# Altium project devkit-visao.PrjPcb (part 1 of 2)
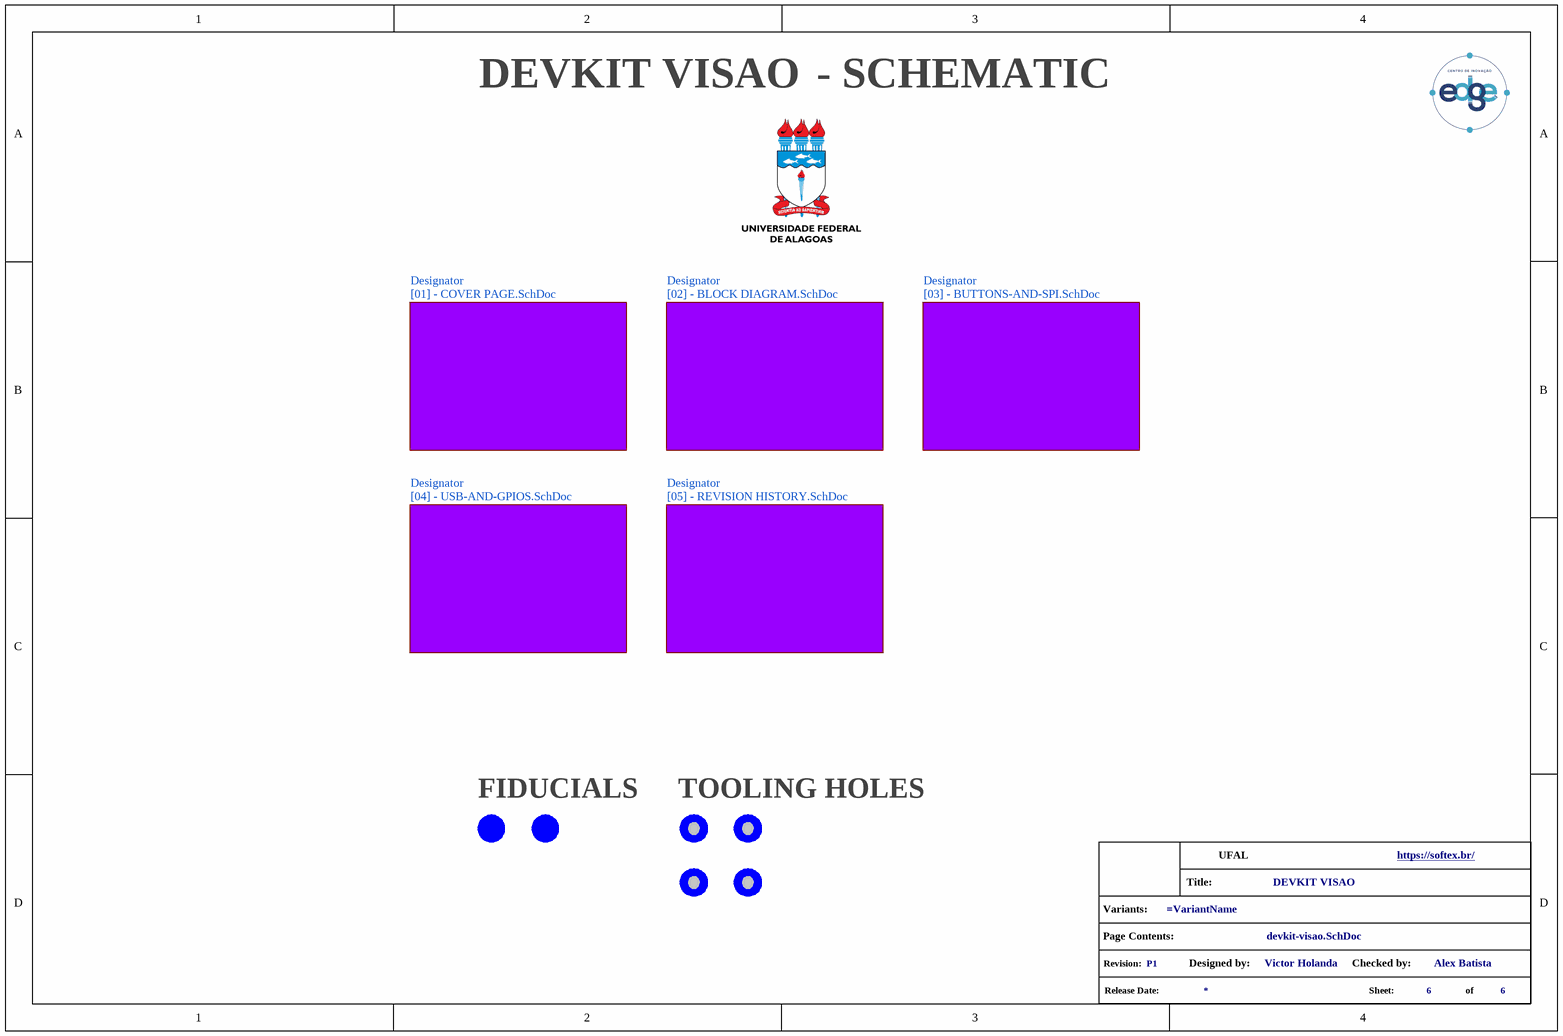
[diagram p0: devkit-visao.SchDoc]
CheckedProject: Alex Batista; Company: UFAL; DesignedProject: Victor Holanda; NotFitted: NF; TitleProject: DEVKIT VISAO; VersionRevision: P1; Website: https://softex.br/
6 sheets, 135 parts. Net scope: global (net labels, ports and power ports of the same name join across sheets).
Board file: devkit-visao.PcbDoc
Sheets:
  devkit-visao.SchDoc
    Designator = [02] - BLOCK DIAGRAM.SchDoc
    Designator = [01] - COVER PAGE.SchDoc
    Designator = [04] - USB-AND-GPIOS.SchDoc
    Designator = [05] - REVISION HISTORY.SchDoc
    Designator = [03] - BUTTONS-AND-SPI.SchDoc

## Sheet devkit-visao.SchDoc
size A4; DocumentNumber: 6; SheetNumber: 6; SheetTotal: 6

### Parts
(Parts that share a designator on the sheet are numbered #1, #2 ... from top to bottom, then left to right.)
*?#1  info_project  (value not drawn)  (graphical)
FID1  FID_40X1.20  [FID_40X1.20]  (value not drawn)  (no BOM)
FID2  FID_40X1.20  [FID_40X1.20]  (value not drawn)  (no BOM)
TH1  Tooling Hole  [Tooling Hole]  (value not drawn)  (no BOM)
TH2  Tooling Hole  [Tooling Hole]  (value not drawn)  (no BOM)
TH3  Tooling Hole  [Tooling Hole]  (value not drawn)  (no BOM)
TH4  Tooling Hole  [Tooling Hole]  (value not drawn)  (no BOM)

### Sub-sheets
Designator = [02] - BLOCK DIAGRAM.SchDoc: no entries
Designator = [01] - COVER PAGE.SchDoc: no entries
Designator = [04] - USB-AND-GPIOS.SchDoc: no entries
Designator = [05] - REVISION HISTORY.SchDoc: no entries
Designator = [03] - BUTTONS-AND-SPI.SchDoc: no entries

### Notes on the sheet
- - SCHEMATIC
- FIDUCIALS
- TOOLING HOLES
- (in symbol info_project) Title:; Variants:; Page Contents:; Revision:; Designed by:; Checked by:; Release Date:; Sheet:; of

### Library data of the parts
*?#1 = info_project: GRAPHICAL - Info Project
FID1 FID2 = FID_40X1.20: Fiducials
TH1-TH4 = Tooling Hole: MECH - Tooling Holes

## Sheet [02] - BLOCK DIAGRAM.SchDoc
size A2; DocumentNumber: 2; SheetNumber: 2; SheetTotal: 6; PageSetup: Record=PageOptions|CenterHorizontal=True|CenterVertical=True|PrintScale=0.52|XCorrection=1.00|YCorrection=1.00|PrintKind=1|BorderSize=5000000|LeftOffset=0|BottomOffset=0|Orientation=2|PaperLength=1000|PaperWidth=1000|Scale=100|PaperSource=4|PrintQuality=600|MediaType=1|DitherType=10|PrintScaleMode=1|PaperKind=A4|PaperIndex=9
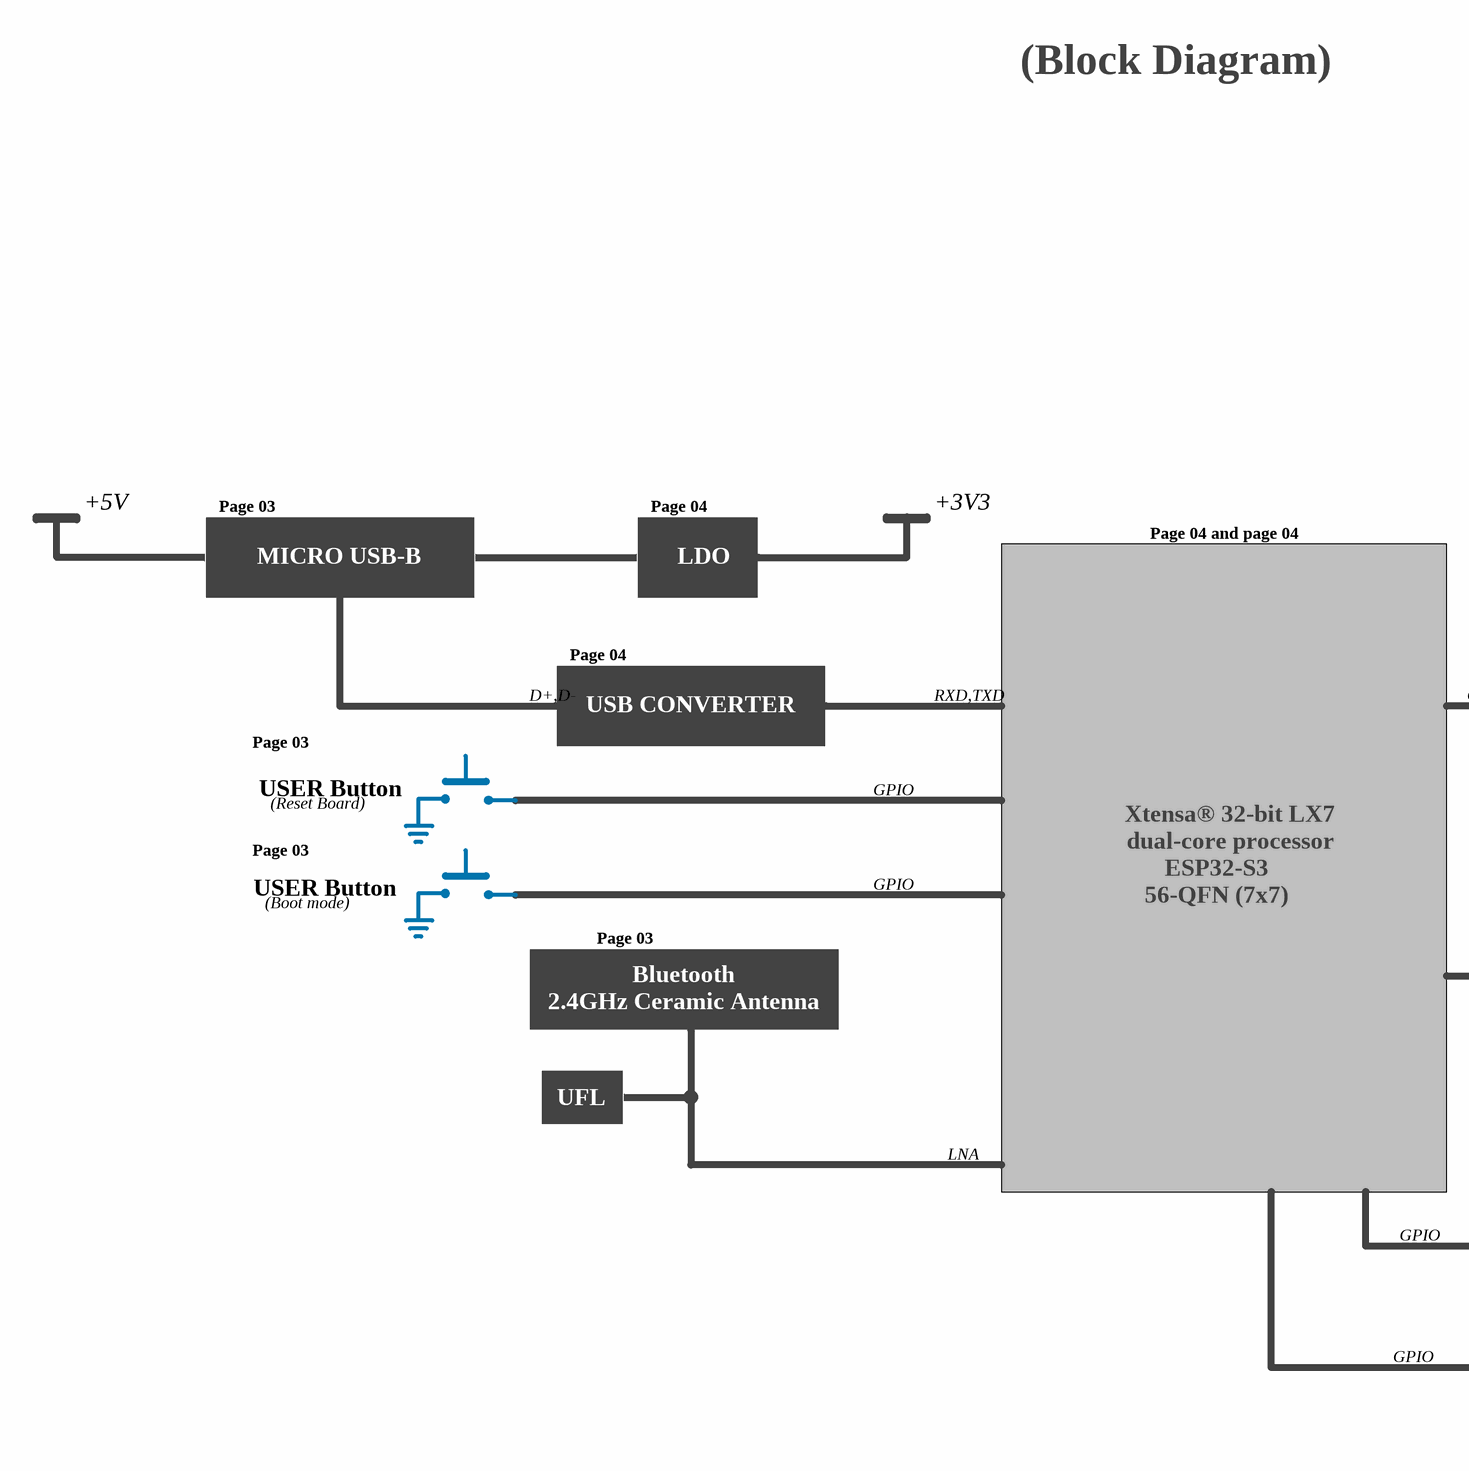
[diagram p1: [02] - BLOCK DIAGRAM.SchDoc, left]
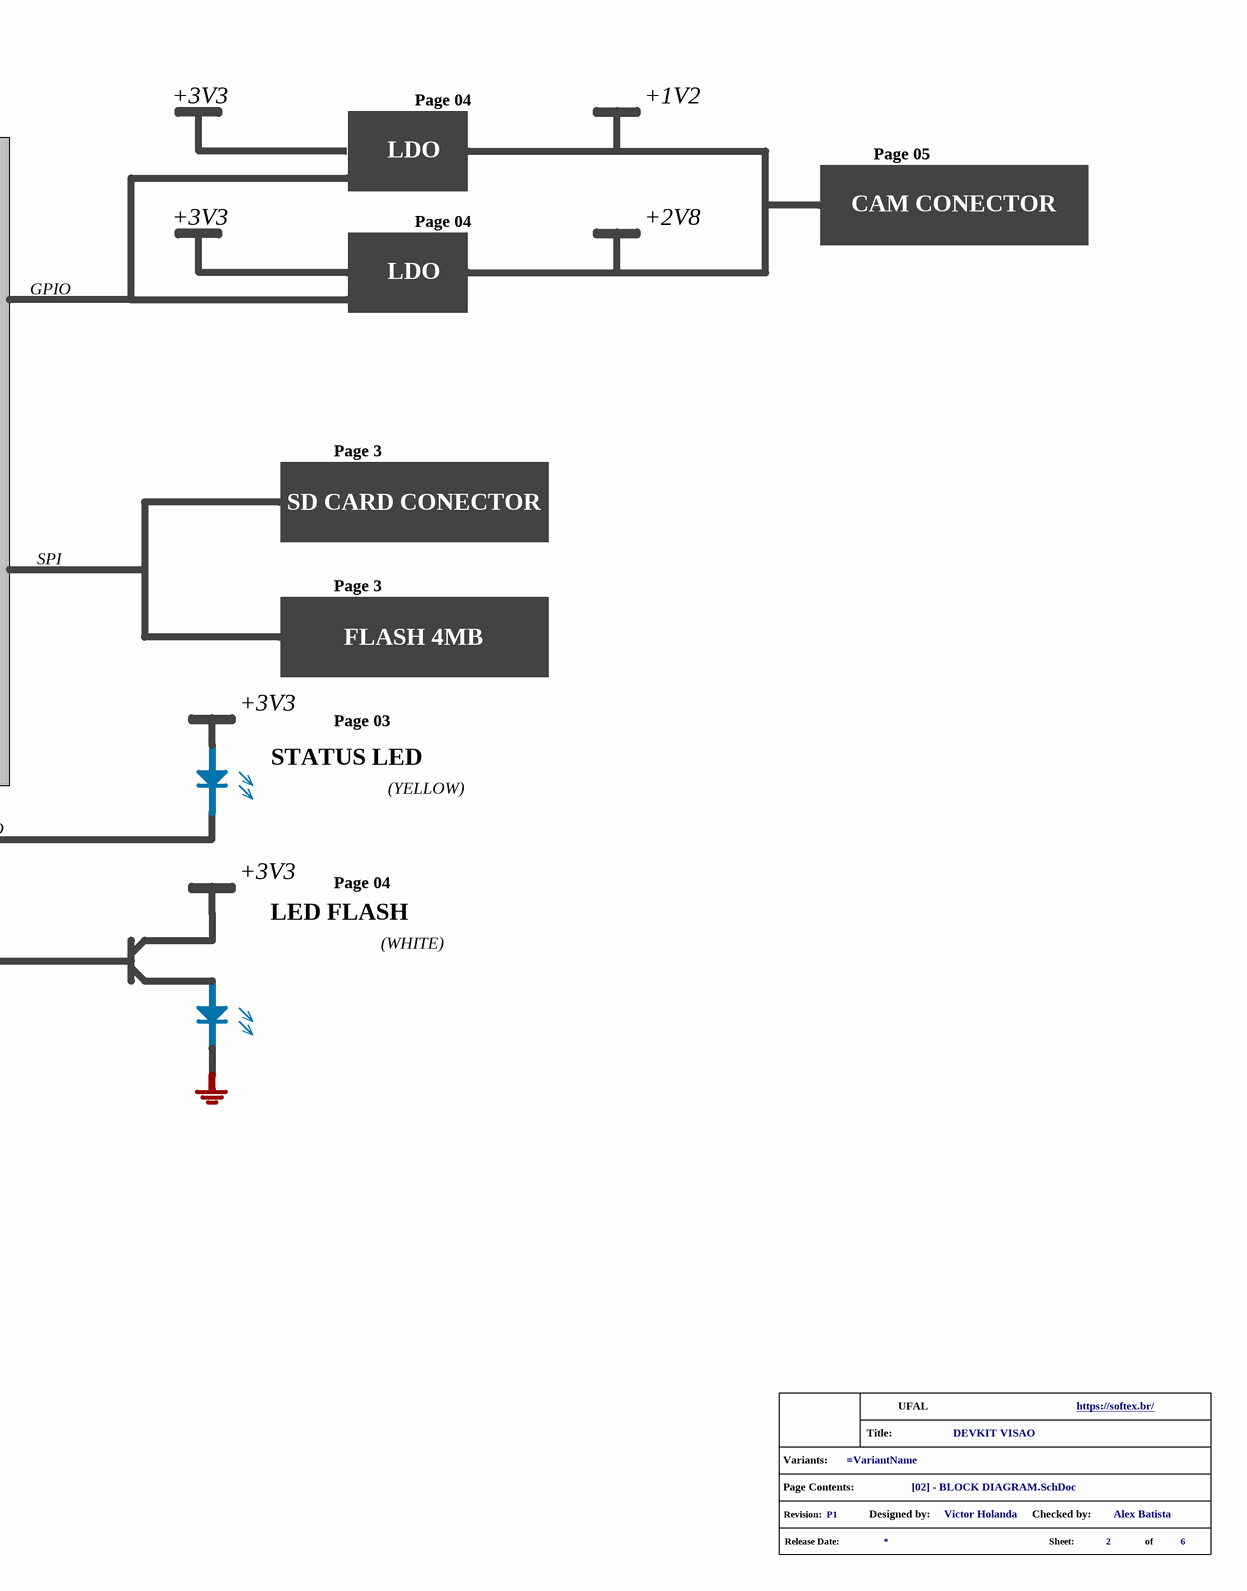
[diagram p2: [02] - BLOCK DIAGRAM.SchDoc, right]

### Parts
(Parts that share a designator on the sheet are numbered #1, #2 ... from top to bottom, then left to right.)
GPH?#1  info_project  (value not drawn)  (graphical)

### Notes on the sheet
- (Block Diagram)
- +5V
- Page 03
- Page 04
- +3V3
- Page 04 and page 04
- +1V2
- MICRO USB-B
- LDO
- Page 05
- +2V8
- CAM CONECTOR
- D+,D-
- USB CONVERTER
- RXD,TXD
- GPIO
- (Reset Board)
- USER Button
- Xtensa® 32-bit LX7
- ESP32-S3
- dual-core processor
- Page 3
- (Boot mode)
- 56-QFN (7x7)
- SD CARD CONECTOR
- 2.4GHz Ceramic Antenna
- Bluetooth
- SPI
- FLASH 4MB
- UFL
- LNA
- STATUS LED
- (YELLOW)
- LED FLASH
- (WHITE)
- (in symbol info_project) Title:; Variants:; Page Contents:; Revision:; Designed by:; Checked by:; Release Date:; Sheet:; of

### Library data of the parts
GPH?#1 = info_project: GRAPHICAL - Info Project

## Sheet [01] - COVER PAGE.SchDoc
size A3; DocumentNumber: 1; SheetNumber: 1; SheetTotal: 6
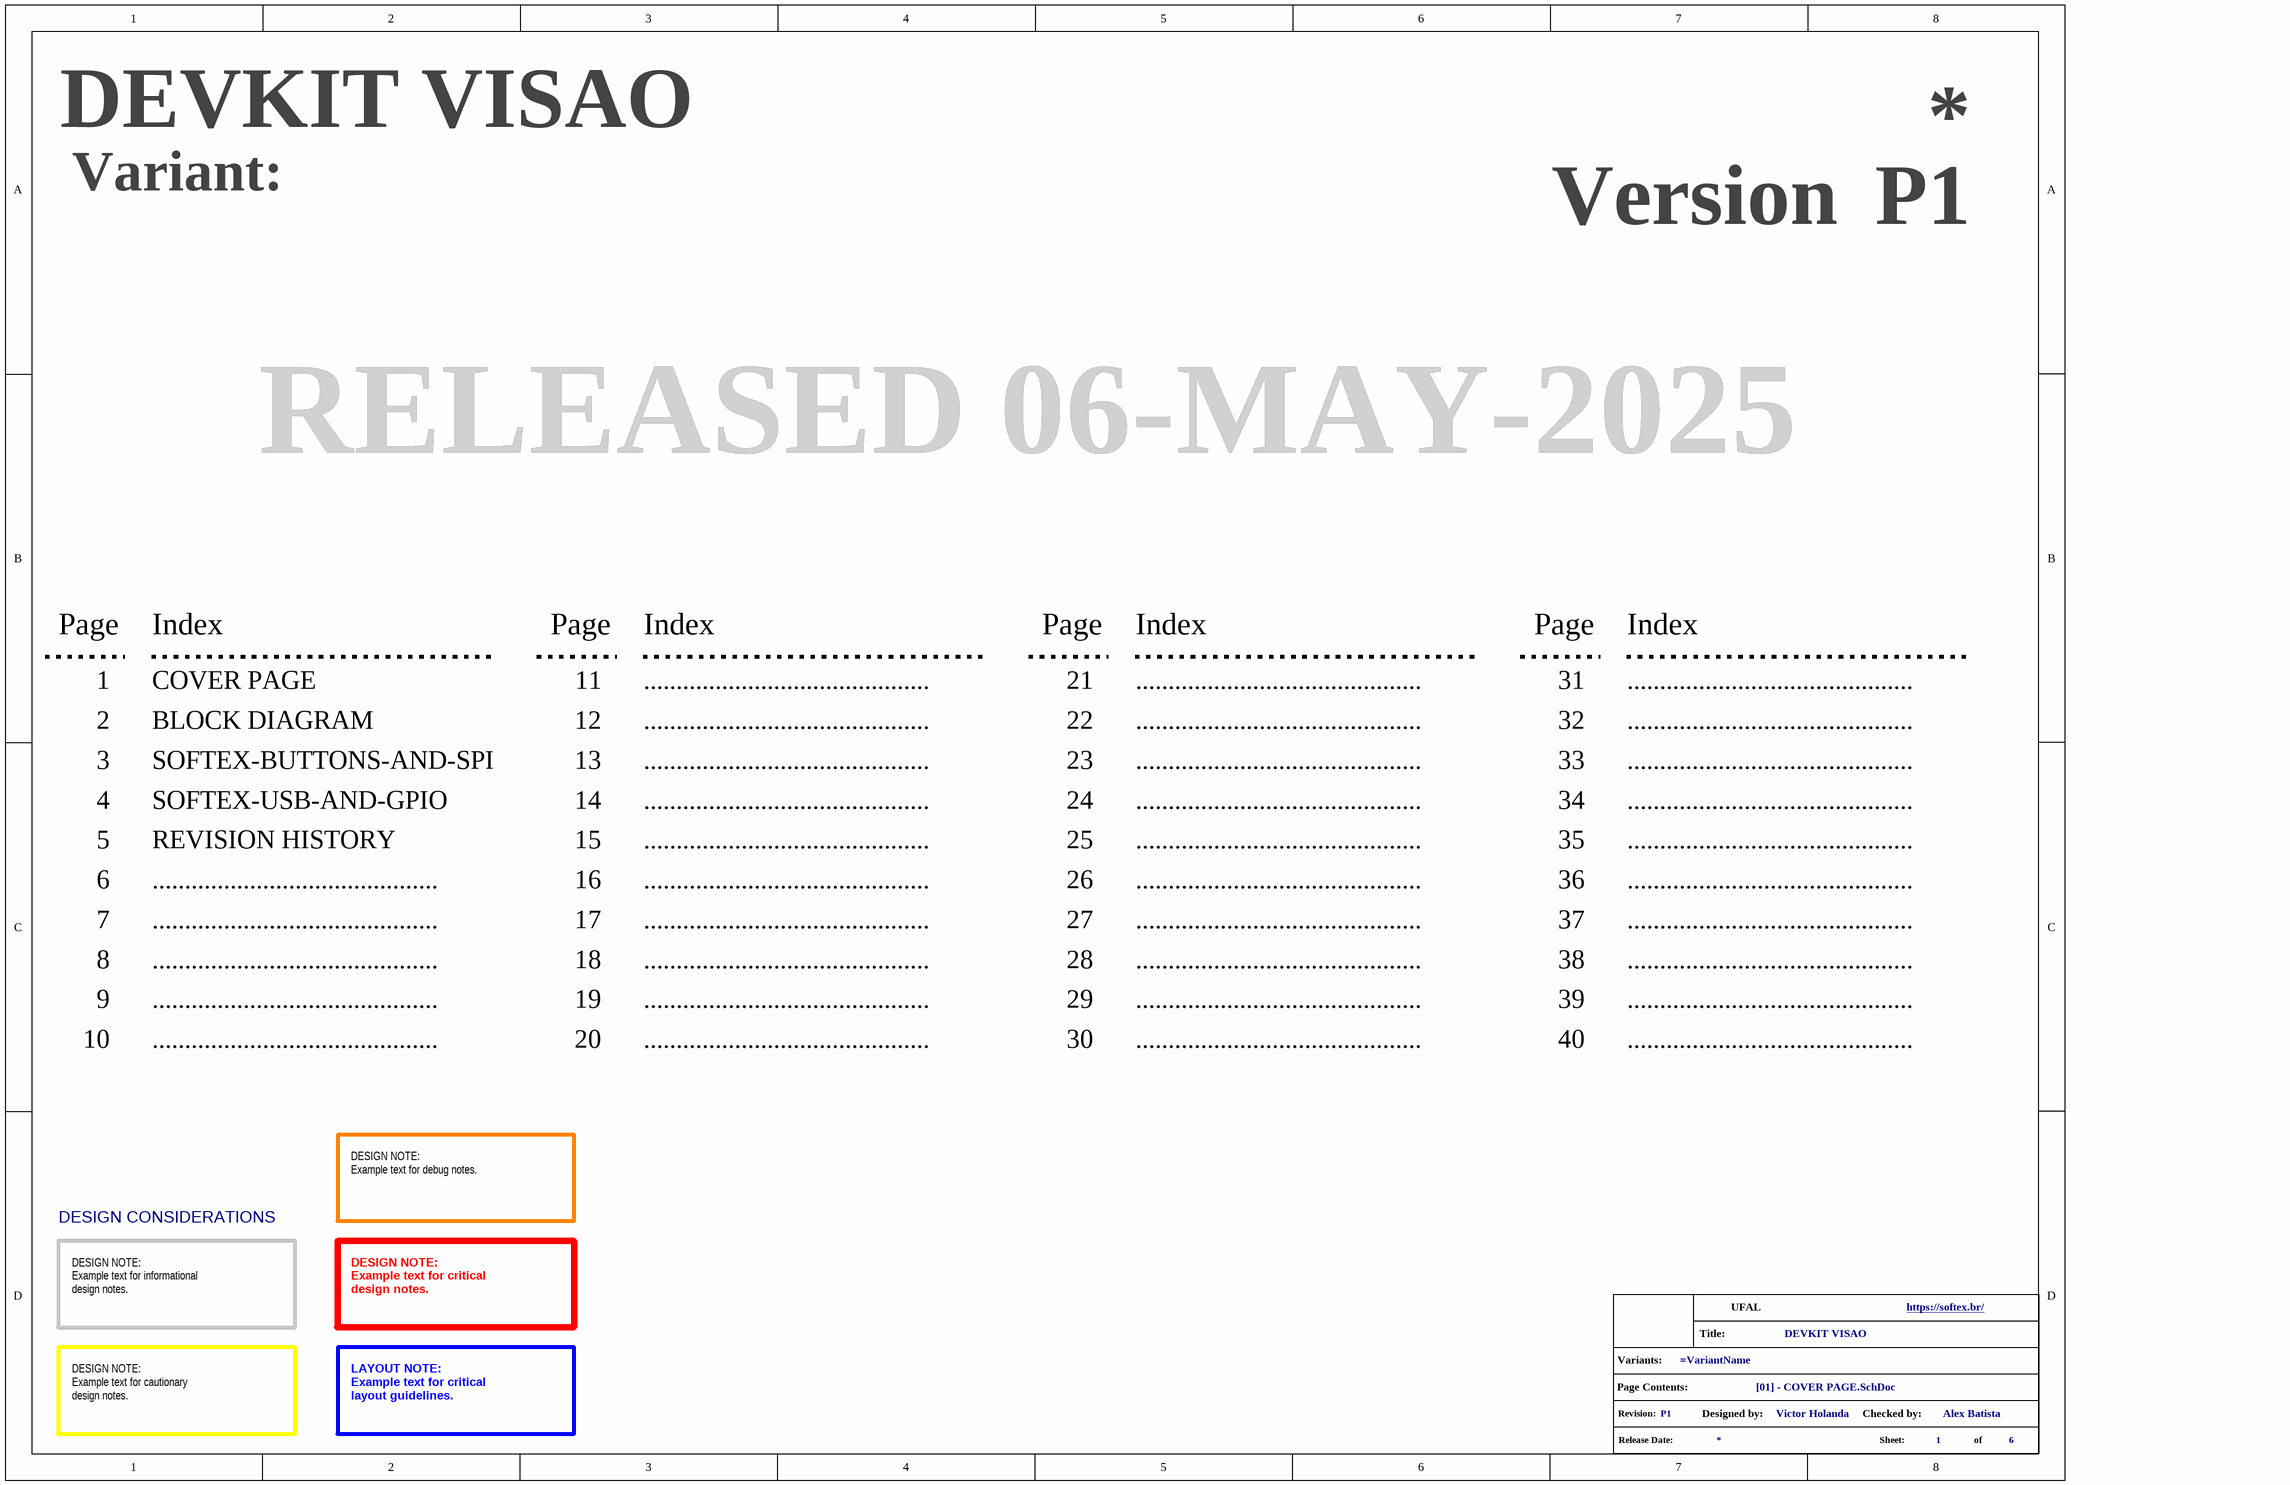
[diagram p3: [01] - COVER PAGE.SchDoc]

### Parts
(Parts that share a designator on the sheet are numbered #1, #2 ... from top to bottom, then left to right.)
GPH?#2  info_project  (value not drawn)  (graphical)

### Notes on the sheet
- Variant:
- Version
- RELEASED 06-MAY-2025
- Page
- Index
- 1
- COVER PAGE
- 11
- ............................................
- 21
- 31
- 2
- 3
- BLOCK DIAGRAM
- SOFTEX-BUTTONS-AND-SPI
- 12
- 13
- 22
- 23
- 32
- 33
- 4
- SOFTEX-USB-AND-GPIO
- 14
- 24
- 34
- 5
- 6
- REVISION HISTORY
- 15
- 16
- 25
- 26
- 35
- 36
- 7
- 8
- 17
- 18
- 27
- 28
- 37
- 38
- 9
- 19
- 29
- 39
- 10
- 20
- 30
- 40
- DESIGN CONSIDERATIONS
- DESIGN NOTE:
  Example text for debug notes.
- DESIGN NOTE:
  Example text for informational
  design notes.
- DESIGN NOTE:
  Example text for critical
  design notes.
- DESIGN NOTE:
  Example text for cautionary
  design notes.
- LAYOUT NOTE:
  Example text for critical
  layout guidelines.
- (in symbol info_project) Title:; Variants:; Page Contents:; Revision:; Designed by:; Checked by:; Release Date:; Sheet:; of

### Library data of the parts
GPH?#2 = info_project: GRAPHICAL - Info Project

## Sheet [04] - USB-AND-GPIOS.SchDoc
size A3; DocumentNumber: 4; SheetNumber: 4; SheetTotal: 6
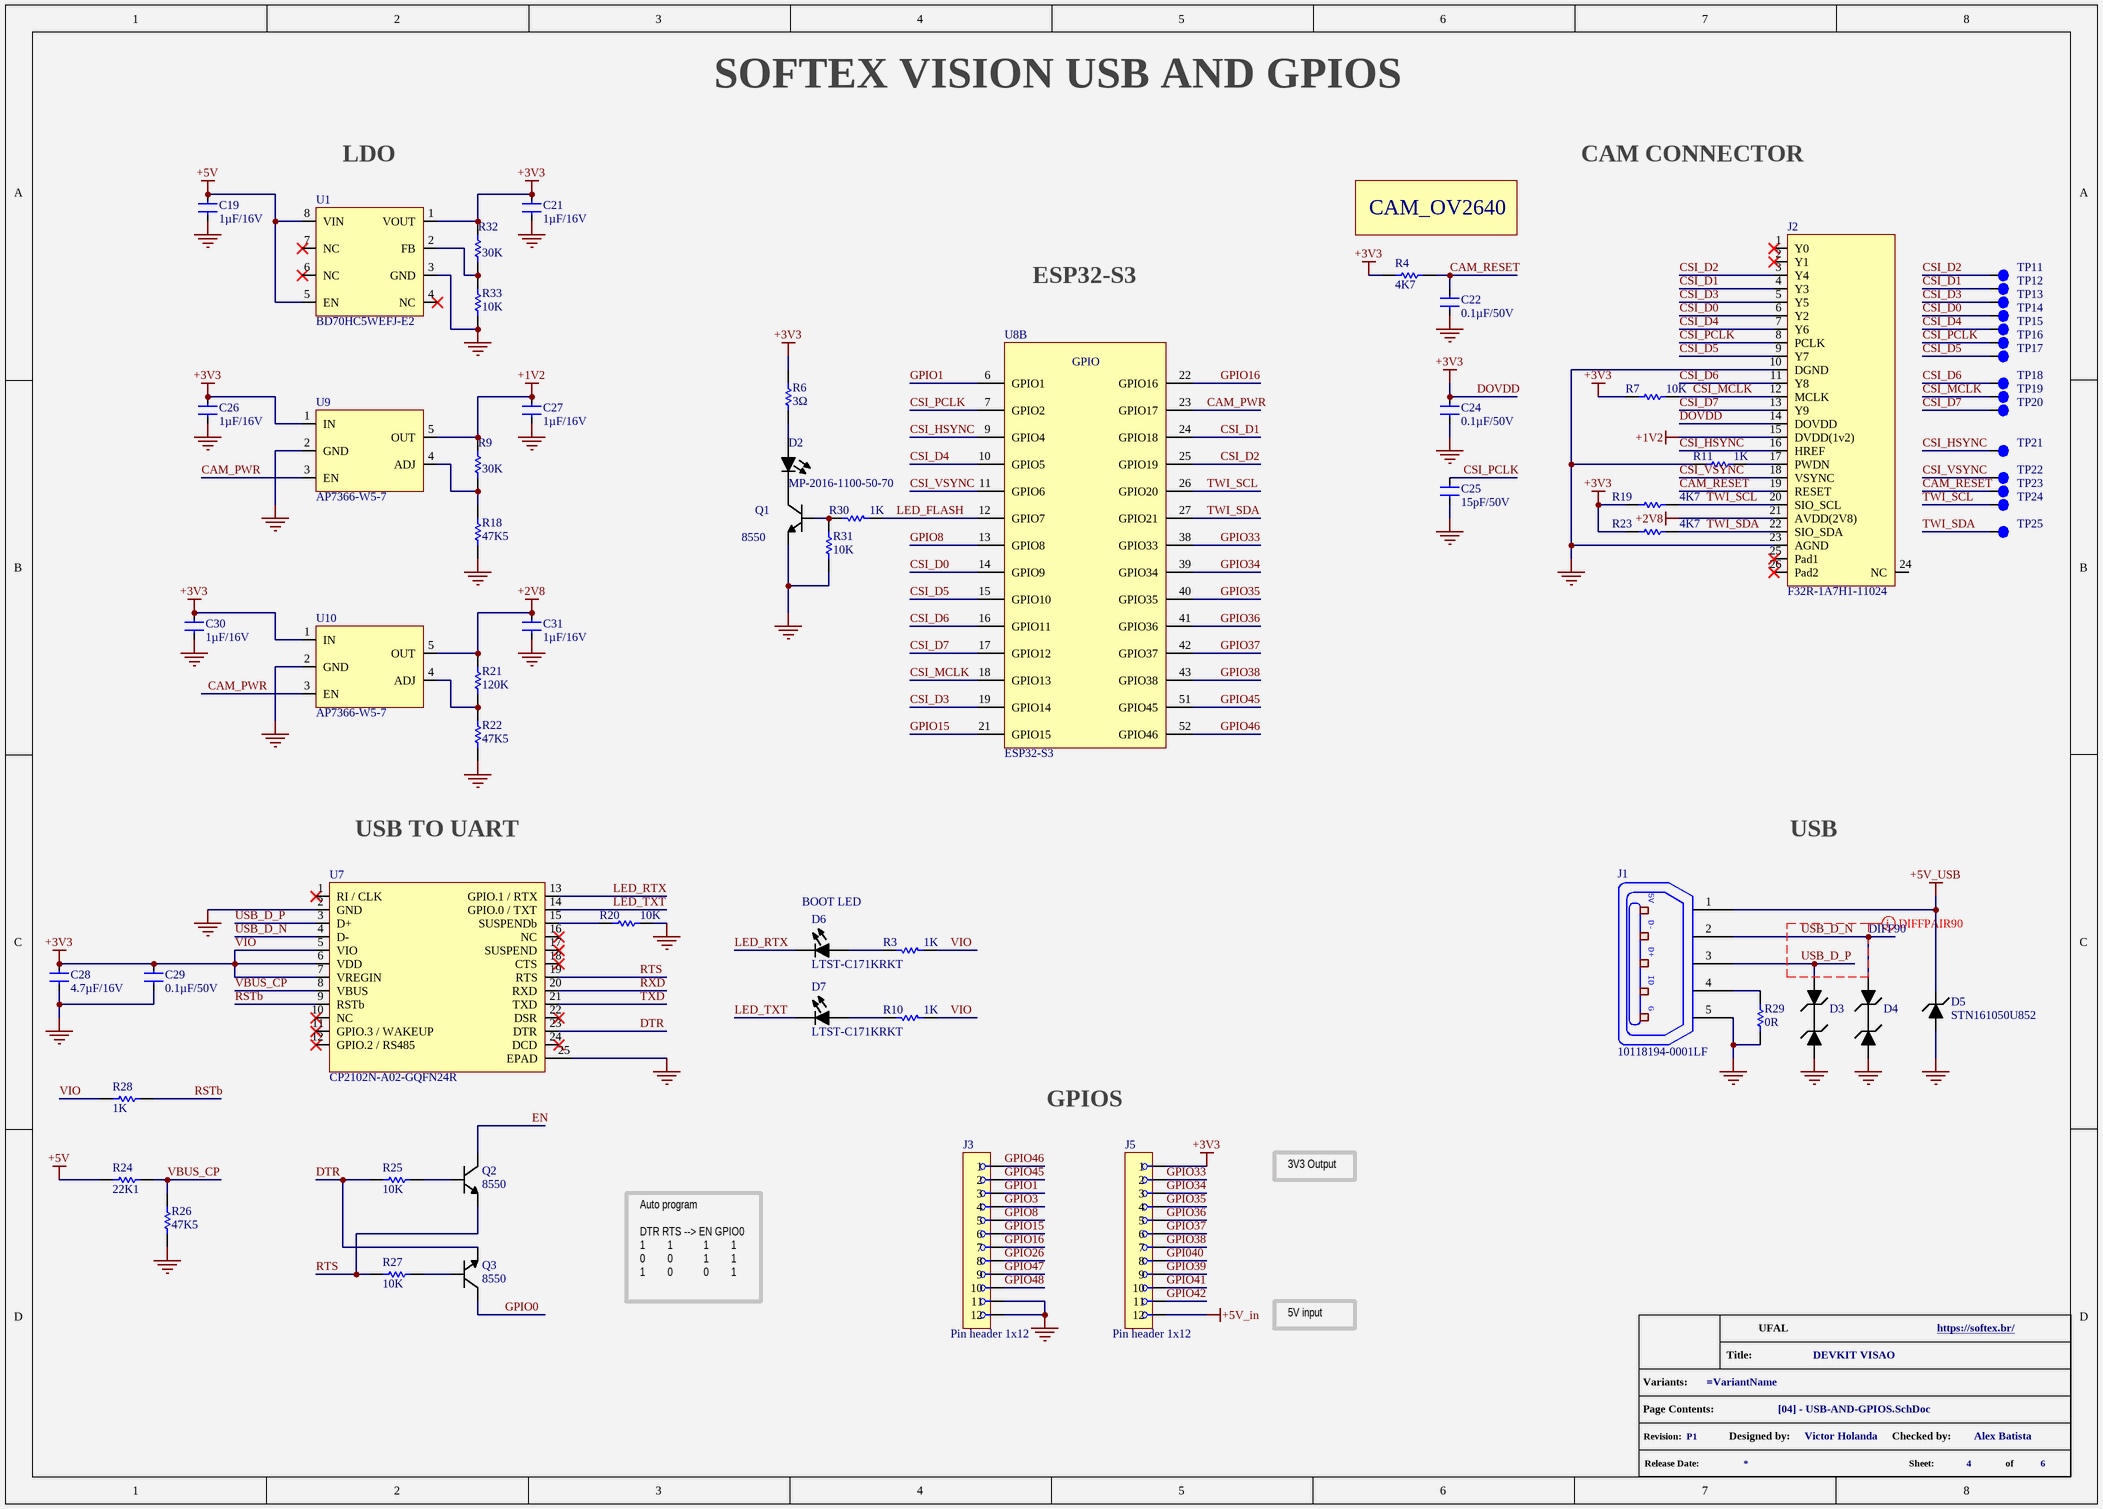
[diagram p4: [04] - USB-AND-GPIOS.SchDoc]

### Parts
(Parts that share a designator on the sheet are numbered #1, #2 ... from top to bottom, then left to right.)
*  CAM_OV2640  (value not drawn)  (mechanical)
C19  1µF/16V  [C0805]
C21  1µF/16V  [C0805]
C22  0.1µF/50V  [C0805]
C24  0.1µF/50V  [C0805]
C25  15pF/50V  [C0805]
C26  1µF/16V  [C0805]
C27  1µF/16V  [C0805]
C28  4.7µF/16V  [C0805]
C29  0.1µF/50V  [C0805]
C30  1µF/16V  [C0805]
C31  1µF/16V  [C0805]
D2  MP-2016-1100-50-70  [MP-2016-1100-50-70]
D3  SZESD7451N2T5G  [SZESD7451N2T5G]  (value not drawn)
D4  SZESD7451N2T5G  [SZESD7451N2T5G]  (value not drawn)
D5  STN161050U852  [STN161050U852]
D6  LTST-C171KRKT  [LTST-C171KRKT]
D7  LTST-C171KRKT  [LTST-C171KRKT]
GPH?#3  info_project  (value not drawn)  (graphical)
J1  10118194-0001LF  [10118194-0001LF]
J2  F32R-1A7H1-11024  [F32R1A7H111024]
J3  Pin header 1x12  [PH1-12-UA]
J5  Pin header 1x12  [PH1-12-UA]
Q1  8550  [MMSS8050-H-TP]
Q2  8550  [MMSS8050-H-TP]
Q3  8550  [MMSS8050-H-TP]
R3  1K  [R0805]
R4  4K7  [R0805]
R6  3Ω  [R0805]
R7  10K  [R0805]
R9  30K  [R0805]
R10  1K  [R0805]
R11  1K  [R0805]
R18  47K5  [R0805]
R19  4K7  [R0805]
R20  10K  [R0805]
R21  120K  [R0805]
R22  47K5  [R0805]
R23  4K7  [R0805]
R24  22K1  [R0805]
R25  10K  [R0805]
R26  47K5  [R0805]
R27  10K  [R0805]
R28  1K  [R0805]
R29  0R  [R0805]
R30  1K  [R0805]
R31  10K  [R0805]
R32  30K  [R0805]
R33  10K  [R0805]
TP11  TestPoint  [Test Point]  (value not drawn)  (no BOM)
TP12  TestPoint  [Test Point]  (value not drawn)  (no BOM)
TP13  TestPoint  [Test Point]  (value not drawn)  (no BOM)
TP14  TestPoint  [Test Point]  (value not drawn)  (no BOM)
TP15  TestPoint  [Test Point]  (value not drawn)  (no BOM)
TP16  TestPoint  [Test Point]  (value not drawn)  (no BOM)
TP17  TestPoint  [Test Point]  (value not drawn)  (no BOM)
TP18  TestPoint  [Test Point]  (value not drawn)  (no BOM)
TP19  TestPoint  [Test Point]  (value not drawn)  (no BOM)
TP20  TestPoint  [Test Point]  (value not drawn)  (no BOM)
TP21  TestPoint  [Test Point]  (value not drawn)  (no BOM)
TP22  TestPoint  [Test Point]  (value not drawn)  (no BOM)
TP23  TestPoint  [Test Point]  (value not drawn)  (no BOM)
TP24  TestPoint  [Test Point]  (value not drawn)  (no BOM)
TP25  TestPoint  [Test Point]  (value not drawn)  (no BOM)
U1  BD70HC5WEFJ-E2  [BD70HC5WEFJ-E2]
U7  CP2102N-A02-GQFN24R  [CP2102N-A02-GQFN24]
U8  ESP32-S3  [ESP32-S3]  (part B of 2)
U9  AP7366-W5-7  [AP7366-W5-7]
U10  AP7366-W5-7  [AP7366-W5-7]

### Nets
+1V2: C27.2 J2.15(DVDD(1v2)) R9.2 U9.5(OUT)
+2V8: C31.2 J2.21(AVDD(2V8)) R21.2 U10.5(OUT)
+3V3: C21.2 C24.1 C26.2 C28.2 C29.2 C30.2 J2.14(DOVDD) J5.1 R3.1 R4.1 R6.2 R7.1 R10.1 R19.1 R23.1 R28.1 R32.2 U1.1(VOUT) U7.5(VIO) U7.6(VDD) U7.7(VREGIN) U9.1(IN) U10.1(IN)  [also labelled DOVDD, VIO]
+5V: C19.2 R24.2 U1.5(EN) U1.8(VIN)
+5V_in: J5.12
+5V_USB: D5.1 J1.1
GND: C19.1 C21.1 C22.2 C24.2 C25.1 C26.1 C27.1 C28.1 C29.1 C30.1 C31.1 D3.2 D4.2 D5.2 J1.5 J2.10(DGND) J2.23(AGND) J3.11 J3.12 Q1.2(E) R11.1 R18.1 R20.2 R22.1 R26.1 R29.1 R31.1 R33.1 U1.3(GND) U7.2(GND) U7.25(EPAD) U9.2(GND) U10.2(GND)
CAM_PWR: U8.23(GPIO17) U9.3(EN) U10.3(EN)
CAM_RESET: C22.1 J2.19(RESET) R4.2 TP23.1
CSI_D0: J2.6(Y2) TP14.1 U8.14(GPIO9)
CSI_D1: J2.4(Y3) TP12.1 U8.24(GPIO18)
CSI_D2: J2.3(Y4) TP11.1 U8.25(GPIO19)
CSI_D3: J2.5(Y5) TP13.1 U8.19(GPIO14)
CSI_D4: J2.7(Y6) TP15.1 U8.10(GPIO5)
CSI_D5: J2.9(Y7) TP17.1 U8.15(GPIO10)
CSI_D6: J2.11(Y8) TP18.1 U8.16(GPIO11)
CSI_D7: J2.13(Y9) TP20.1 U8.17(GPIO12)
CSI_HSYNC: J2.16(HREF) TP21.1 U8.9(GPIO4)
CSI_MCLK: J2.12(MCLK) R7.2 TP19.1 U8.18(GPIO13)
CSI_PCLK: C25.2 J2.8(PCLK) TP16.1 U8.7(GPIO2)
CSI_VSYNC: J2.18(VSYNC) TP22.1 U8.11(GPIO6)
DTR: Q3.2(E) R25.1 U7.23(DTR)
EN: Q2.3(C)
GPI040: J5.8
GPIO0: Q3.3(C)
GPIO1: J3.3 U8.6(GPIO1)
GPIO3: J3.4
GPIO8: J3.5 U8.13(GPIO8)
GPIO15: J3.6 U8.21(GPIO15)
GPIO16: J3.7 U8.22(GPIO16)
GPIO26: J3.8
GPIO33: J5.2 U8.38(GPIO33)
GPIO34: J5.3 U8.39(GPIO34)
GPIO35: J5.4 U8.40(GPIO35)
GPIO36: J5.5 U8.41(GPIO36)
GPIO37: J5.6 U8.42(GPIO37)
GPIO38: J5.7 U8.43(GPIO38)
GPIO39: J5.9
GPIO41: J5.10
GPIO42: J5.11
GPIO45: J3.2 U8.51(GPIO45)
GPIO46: J3.1 U8.52(GPIO46)
GPIO47: J3.9
GPIO48: J3.10
LED_FLASH: R30.2 U8.12(GPIO7)
LED_RTX: D6.2 U7.13(GPIO.1_/_RTX)
LED_TXT: D7.2 U7.14(GPIO.0_/_TXT)
RSTb: R28.2 U7.9(RSTb)
RTS: Q2.2(E) R27.1 U7.19(RTS)
RXD: U7.20(RXD)
TWI_SCL: J2.20(SIO_SCL) R19.2 TP24.1 U8.26(GPIO20)
TWI_SDA: J2.22(SIO_SDA) R23.2 TP25.1 U8.27(GPIO21)
TXD: U7.21(TXD)
USB_D_N: D4.1 J1.2 U7.4(D-)
USB_D_P: D3.1 J1.3 U7.3(D+)
VBUS_CP: R24.1 R26.2 U7.8(VBUS)
NetD2_1: D2.1 R6.1
NetD2_2: D2.2 Q1.3(C)
NetD6_1: D6.1 R3.2
NetD7_1: D7.1 R10.2
NetJ1_4: J1.4 R29.2
NetJ2_17: J2.17(PWDN) R11.2
NetQ1_1: Q1.1(B) R30.1 R31.2
NetQ2_1: Q2.1(B) R25.2
NetQ3_1: Q3.1(B) R27.2
NetR9_1: R9.1 R18.2 U9.4(ADJ)
NetR20_1: R20.1 U7.15(SUSPENDb)
NetR21_1: R21.1 R22.2 U10.4(ADJ)
NetR32_1: R32.1 R33.2 U1.2(FB)

Not connected (* = marked no-connect by the designer): J2 1(Y0)* 2(Y1)* 24(NC) 25(Pad1)* 26(Pad2)*; U1 4(NC)* 6(NC)* 7(NC)*; U7 1(RI_/_CLK)* 10(NC)* 11(GPIO.3_/_WAKEUP)* 12(GPIO.2_/_RS485)* 16(NC)* 17(SUSPEND)* 18(CTS)* 22(DSR)* 24(DCD)*

### Layout directives
differential pair; differential pair class DIFF90: USB_D_N, USB_D_P

### Notes on the sheet
- SOFTEX VISION USB AND GPIOS
- LDO
- CAM CONNECTOR
- ESP32-S3
- USB TO UART
- USB
- BOOT LED
- GPIOS
- 3V3 Output
- Auto program
  DTR RTS --> EN GPIO0
  1        1           1        1
  0        0           1        1
  1        0           0        1
  0        1           1        0
- 5V input
- (in symbol 10118194-0001LF) 5V; D-; D+; ID; G
- (in symbol ESP32-S3, part B) GPIO
- (in symbol info_project) Title:; Variants:; Page Contents:; Revision:; Designed by:; Checked by:; Release Date:; Sheet:; of

### Library data of the parts
C19 C21 C26 C27 C30 C31 = CL21B105KOFNNNE: MLCC - 1µF 0805 16V X7R ±10%; Manufacturer 1: Samsung; .SCHChecked: Victor Holanda; Capacitance: 1uF; .PCBChecked: Victor Holanda; Supplier 1: Digi-Key; RoHS: Yes; Category: Ceramic Capacitors; Stock 1: 1044699; Pricing 1: 1=0,10000, 10=0,05600, 50=0,03060, 100=0,02500, 500=0,01782, 1000=0,01401 (USD); Mount: Surface Mount; Case/Package: 0805; Case Code (Metric): 2012; Case Code (Imperial): 0805; Contact Plating: Tin; Min Operating Temperature: -55°C; Max Operating Temperature: 125°C; Tolerance: 10%; Package Quantity: 1; Packaging: Tape and Reel; Voltage Rating: 16V; Dielectric: X7R; Voltage Rating (DC): 16V; Series: CL; Construction: Flat; Voltage: 16V; Length: 2mm; Width: 0.049inch; Height: 1.25mm; Thickness: 0.053inch; Depth: 1.25mm; Radiation Hardening: No; Lead Free: Lead Free; RoHS Compliant: Yes; ComponentLink3URL: https://datasheet.ciiva.com/25800/cl21b105kofnnne-25800257.pdf?src-supplier=Digi-Key; ComponentLink3Description: https://datasheet.ciiva.com/25800/cl21b105kofnnne-25800257.pdf?src-supplier=Digi-Key; Supplier Part Number 1: 1276-1026-1-ND; Manufacturer Part Number 1: CL21B105KOFNNNE
C22 C24 C29 = CL21B104KBCNNNC: MLCC - 0.1µF 0805 50V X7R ±10%; Manufacturer 1: Samsung; .SCHChecked: Victor Holanda; Material: Ceramic; Capacitance: 100nF; .PCBChecked: Victor Holanda; Supplier 1: Digi-Key; RoHS: Yes; Category: Ceramic Capacitors; Stock 1: 3198898; Pricing 1: 1=0,10000, 10=0,04800, 50=0,02620, 100=0,02140, 500=0,01528, 1000=0,01201 (USD); Mount: Surface Mount; Case/Package: 0805; Case Code (Metric): 2012; Case Code (Imperial): 0805; Contact Plating: Tin; Min Operating Temperature: -55°C; Max Operating Temperature: 125°C; Tolerance: 10%; Dielectric: X7R; Packaging: Tape and Reel; Voltage Rating: 50V; Voltage: 50V; Voltage Rating (DC): 50V; Series: CL; Construction: Flat; Length: 2mm; Width: 0.049inch; Height: 0.85mm; Depth: 1.25mm; Thickness: 0.037inch; Radiation Hardening: No; Lead Free: Lead Free; RoHS Compliant: Yes; ComponentLink3URL: https://datasheet.ciiva.com/25710/cl21b104kbcnnnc-25710182.pdf?src-supplier=Digi-Key; ComponentLink3Description: https://datasheet.ciiva.com/25710/cl21b104kbcnnnc-25710182.pdf?src-supplier=Digi-Key; Supplier 2: Mouser; Supplier Part Number 1: 1276-1003-1-ND; Supplier Part Number 2: 187-CL21B104KBCNNNC; Manufacturer Part Number 1: CL21B104KBCNNNC
C25 = 08055C150KAT2A: MLCC - 15pF 0805 50V X7R ±10%; Manufacturer 1: Kyocera AVX; .SCHChecked: Victor Holanda; .PCBChecked: Victor Holanda; Supplier 1: Digi-Key; Manufacturer Part Number 1: 08055C150KAT2A; RoHS: Yes; Category: Ceramic Capacitors; Stock 1: 16775; Pricing 1: 1=0,23000, 10=0,15700, 50=0,09400, 100=0,07940, 500=0,05434, 1000=0,04807 (USD); Mount: Surface Mount; Case/Package: 0805; Number of Pins: 2; Case Code (Metric): 2012; Case Code (Imperial): 0805; Min Operating Temperature: -55°C; Max Operating Temperature: 125°C; Packaging: Tape and Reel; Capacitance: 15pF; Tolerance: 10%; Package Quantity: 4000; Voltage Rating: 50V; Voltage Rating (DC): 50V; Dielectric: X7R; Termination: SMD/SMT; Construction: Flat; Length: 2.01mm; Width: 0.049inch; Thickness: 0.037inch; Depth: 1.25mm; Radiation Hardening: No; REACH SVHC: Unknown; Supplier 2: Mouser; Supplier Part Number 1: 478-11902-1-ND; Supplier Part Number 2: 581-08055C150KAT2A
C28 = CL21A475KOFNNNE: MLCC - 4.7µF 0805 16V X5R ±10%; Manufacturer 1: Samsung; .SCHChecked: Victor Holanda; Capacitance: 4.7uF; .PCBChecked: Victor Holanda; Supplier 1: Digi-Key; RoHS: Yes; Category: Ceramic Capacitors; Stock 1: 605133; Pricing 1: 1=0,12000, 10=0,08600, 50=0,04880, 100=0,04050, 500=0,02838, 1000=0,02350 (USD); Mount: Surface Mount; Case/Package: 0805; Case Code (Metric): 2012; Case Code (Imperial): 0805; Contact Plating: Tin; Min Operating Temperature: -55°C; Max Operating Temperature: 85°C; Packaging: Tape and Reel; Tolerance: 10%; Voltage Rating: 16V; Dielectric: X5R; Series: CL; Construction: Flat; Length: 2mm; Width: 0.049inch; Height: 1.25mm; Thickness: 0.053inch; Depth: 1.25mm; Radiation Hardening: No; RoHS Compliant: Yes; ComponentLink3URL: https://datasheet.ciiva.com/25710/cl21a475kofnnne-25710354.pdf?src-supplier=Digi-Key; ComponentLink3Description: https://datasheet.ciiva.com/25710/cl21a475kofnnne-25710354.pdf?src-supplier=Digi-Key; ComponentLink4URL: https://datasheet.ciiva.com/16740/cl21a475kofnnne-16740646.pdf?src-supplier=Future+Electronics; ComponentLink4Description: https://datasheet.ciiva.com/16740/cl21a475kofnnne-16740646.pdf?src-supplier=Future+Electronics; ComponentLink5URL: https://datasheet.ciiva.com/26838/getdatasheetpartid-357424-26838625.pdf?src-supplier=Verical; ComponentLink5Description: https://datasheet.ciiva.com/26838/getdatasheetpartid-357424-26838625.pdf?src-supplier=Verical; Supplier Part Number 1: 1276-1065-1-ND; Manufacturer Part Number 1: CL21A475KOFNNNE
D2 = MP-2016-1100-50-70: LED - Uni-Color White 27lm 5000K Chip LED 2-Pin SMD T/R; Manufacturer 1: Luminus Devices; Viewing Angle: 110°; Test Current: 60mA; Color Rendering Index (CRI): 70; Max Current Rating: 120mA; Thermal Resistance of Package: 35°C/W; Lens Style: Rectangular; Forward Voltage: 3V; Number of LEDs: 1; Max Power Dissipation: 816mW; Reverse Voltage: 5V; .PCBChecked: Victor H; Supplier 1: Digi-Key; Manufacturer Part Number 1: MP-2016-1100-50-70; RoHS: Yes; Category: Uncategorized; Stock 1: 60114; Pricing 1: 1=0,16000, 10=0,08600, 100=0,04060, 500=0,03476, 1000=0,02674, 2000=0,02514 (USD); Mount: Surface Mount; Case/Package: 0806; Number of Pins: 2; Color: White; Case Code (Metric): 2016; Case Code (Imperial): 0806; Min Operating Temperature: -40°C; Max Operating Temperature: 80°C; Packaging: Tape and Reel; Correlated Color Temperature (CCT): 5000 K; Luminous Flux: 27lm; RoHS Compliant: Yes; ComponentLink1URL: https://datasheet.ciiva.com/48679/luminus-mp2016-datasheet-48679211.pdf?src-supplier=Avnet; ComponentLink1Description: https://datasheet.ciiva.com/48679/luminus-mp2016-datasheet-48679211.pdf?src-supplier=Avnet; Supplier Part Number 1: 1214-1209-1-ND; .SCHChecked: Victor H
D3 D4 = SZESD7451N2T5G: Transient Voltage Suppressors low cap ESD protection in SOD-882; Manufacturer 1: ON Semiconductor; Direction: Bidirectional; Capacitance: 0.35pF; Number of Bidirectional Channels: 1; Reverse Standoff Voltage: 3.3V; Min Breakdown Voltage: 6V; Power Line Protection: No; Clamping Voltage: 13V; Element Configuration: Single; .SCHChecked: Victor H; Supplier 1: Digi-Key; Manufacturer Part Number 1: SZESD7451N2T5G; RoHS: Yes; Category: TVS Diodes; Stock 1: 36434; Pricing 1: 1=0,49000, 10=0,42100, 100=0,31430, 500=0,24696, 1000=0,19083, 2000=0,17400 (USD); Mount: Surface Mount; Number of Pins: 2; Min Operating Temperature: -55°C; Max Operating Temperature: 150°C; Packaging: Tape and Reel; Working Voltage: 3.3V; Resistor Type: Zener; Lead Free: Lead Free; RoHS Compliant: Yes; ComponentLink1URL: https://datasheet.ciiva.com/48533/esd7451-d-48533317.pdf?src-supplier=Avnet; ComponentLink1Description: https://datasheet.ciiva.com/48533/esd7451-d-48533317.pdf?src-supplier=Avnet; Supplier Part Number 1: SZESD7451N2T5GOSCT-ND; .PCBChecked: Victor H
D5 = STN161050U852: DIODE - ESD Suppressor TVS Single Uni-Dir 30KV 2-Pin SMD; Manufacturer 1: Eaton Bussmann; .SCHChecked: Victor H; Supplier 1: Digi-Key; Manufacturer Part Number 1: STN161050U852; RoHS: No; Stock 1: 8226; Pricing 1: 1=0,50000, 10=0,37600, 100=0,23410, 500=0,16016, 1000=0,12320 (USD); Supplier Part Number 1: 283-STN161050U852CT-ND; .PCBChecked: Victor H
D6 D7 = LTST-C171KRKT: LED - RED 2-Pin SMD 0805; Manufacturer 1: Vishay Lite-On; Lens Color: Colorless; Viewing Angle: 130°; Lens Style: Diffused,Colorless,Rectangular,Clear; Forward Current: 30mA; Forward Voltage: 2V; Luminous Intensity: 54mcd; Lens Transparency: Clear; Test Current: 20mA; Dominant Wavelength: 631nm; Number of Elements: 1; Power Dissipation: 75mW; Wavelength: 639nm; Reverse Voltage: 5V; .SCHChecked: Jonatha O.; Supplier 1: Digi-Key; Manufacturer Part Number 1: LTST-C171KRKT; Stock 1: 300217; Pricing 1: 1=0.28000, 10=0.15000, 100=0.06990, 500=0.06450, 1000=0.05052 (USD); RoHS: Yes; Mount: Surface Mount; Case/Package: 0805; Number of Pins: 2; Color: Red; Case Code (Metric): 2012; Case Code (Imperial): 0805; Min Operating Temperature: -55°C; Max Operating Temperature: 85°C; Package Quantity: 3000; Packaging: Tape and Reel; Illumination Color: Red; Number of LEDs: 1; Series: -; Power Rating: 75mW; Length: 2mm; Width: 1.25mm; Height: 0.8mm; Depth: 1.25mm; Radiation Hardening: No; Lead Free: Lead Free; RoHS Compliant: Yes; ComponentLink1URL: https://datasheet.ciiva.com/12403/lite-on-ltst-c171krkt-187201-12403781.pdf?src-supplier=Mouser; ComponentLink1Description: https://datasheet.ciiva.com/12403/lite-on-ltst-c171krkt-187201-12403781.pdf?src-supplier=Mouser; ComponentLink2URL: https://datasheet.ciiva.com/11775/0900766b80dc0299-11775643.pdf?src-supplier=RSComponents; ComponentLink2Description: https://datasheet.ciiva.com/11775/0900766b80dc0299-11775643.pdf?src-supplier=RSComponents; ComponentLink3URL: https://datasheet.ciiva.com/16444/lite-on20ltst-c171krkt-16444779.pdf?src-supplier=Future+Electronics; ComponentLink3Description: https://datasheet.ciiva.com/16444/lite-on20ltst-c171krkt-16444779.pdf?src-supplier=Future+Electronics; ComponentLink4URL: https://datasheet.ciiva.com/2110/s-110-ltst-c171krkt-2110066.pdf?src-supplier=Digi-Key; ComponentLink4Description: https://datasheet.ciiva.com/2110/s-110-ltst-c171krkt-2110066.pdf?src-supplier=Digi-Key; ComponentLink5URL: https://datasheet.ciiva.com/2110/s-110-ltst-c171krkt-2110067.pdf?src-supplier=Digi-Key; ComponentLink5Description: https://datasheet.ciiva.com/2110/s-110-ltst-c171krkt-2110067.pdf?src-supplier=Digi-Key; ComponentLink6URL: https://datasheet.ciiva.com/2110/s-110-ltst-c171krkt-2110068.pdf?src-supplier=Digi-Key; ComponentLink6Description: https://datasheet.ciiva.com/2110/s-110-ltst-c171krkt-2110068.pdf?src-supplier=Digi-Key; Supplier Part Number 1: 160-1427-1-ND; .PCBChecked: Jonatha O.
GPH?#3 = info_project: GRAPHICAL - Info Project
J1 = 10118194-0001LF: CONN - Micro USB Type B RCP 5 POS 0.65mm Solder RA SMD 5 Terminal 1 Port T/R; Manufacturer 1: Amphenol ICC; .PCBChecked: Jose Gomes; .SCHChecked: Victor H; ComponentLink1URL: http://components.arrow.com/part/dataview/0323_04107371?src-supplier=Arrow+Europe; ComponentLink1Description: http://components.arrow.com/part/dataview/0323_04107371?src-supplier=Arrow+Europe; ComponentLink2URL: http://uk.rs-online.com/webdocs/1450/0900766b814507ee.pdf?src-supplier=RSComponents; ComponentLink2Description: http://uk.rs-online.com/webdocs/1450/0900766b814507ee.pdf?src-supplier=RSComponents; ComponentLink3URL: https://cdn.amphenol-icc.com/media/wysiwyg/files/documentation/datasheet/inputoutput/io_usb_micro.pdf?src-supplier=Avnet; ComponentLink3Description: https://cdn.amphenol-icc.com/media/wysiwyg/files/documentation/datasheet/inputoutput/io_usb_micro.pdf?src-supplier=Avnet; ComponentLink4URL: https://cdn.amphenol-icc.com/media/wysiwyg/files/documentation/datasheet/inputoutput/io_usb_micro.pdf?src-supplier=Arrow+Electronics; ComponentLink4Description: https://cdn.amphenol-icc.com/media/wysiwyg/files/documentation/datasheet/inputoutput/io_usb_micro.pdf?src-supplier=Arrow+Electronics; ComponentLink5URL: https://cdn.amphenol-icc.com/media/wysiwyg/files/documentation/datasheet/inputoutput/io_usb_micro.pdf?src-supplier=Verical; ComponentLink5Description: https://cdn.amphenol-icc.com/media/wysiwyg/files/documentation/datasheet/inputoutput/io_usb_micro.pdf?src-supplier=Verical; ComponentLink6URL: http://portal.fciconnect.com/Comergent//fci/drawing/10118192.pdf?src-supplier=Avnet+Asia; ComponentLink6Description: http://portal.fciconnect.com/Comergent//fci/drawing/10118192.pdf?src-supplier=Avnet+Asia; ComponentLink7URL: https://cdn.amphenol-icc.com/media/wysiwyg/files/documentation/datasheet/inputoutput/io_usb_micro.pdf?src-supplier=Allied+Electronics; ComponentLink7Description: https://cdn.amphenol-icc.com/media/wysiwyg/files/documentation/datasheet/inputoutput/io_usb_micro.pdf?src-supplier=Allied+Electronics; ComponentLink8URL: http://www.farnell.com/datasheets/2366786.pdf?src-supplier=Newark; ComponentLink8Description: http://www.farnell.com/datasheets/2366786.pdf?src-supplier=Newark; ComponentLink9URL: https://cdn.amphenol-icc.com/media/wysiwyg/files/documentation/datasheet/inputoutput/io_usb_micro.pdf?src-supplier=Mouser; ComponentLink9Description: https://cdn.amphenol-icc.com/media/wysiwyg/files/documentation/datasheet/inputoutput/io_usb_micro.pdf?src-supplier=Mouser; ComponentLink10URL: http://www.amphenol-icc.com/media/wysiwyg/files/drawing/10118192.pdf?src-supplier=Digi-Key; ComponentLink10Description: http://www.amphenol-icc.com/media/wysiwyg/files/drawing/10118192.pdf?src-supplier=Digi-Key; ComponentLink11URL: http://www.farnell.com/cad/1935767.pdf?src-supplier=Element14; ComponentLink11Description: http://www.farnell.com/cad/1935767.pdf?src-supplier=Element14; ComponentLink12URL: http://www.farnell.com/datasheets/2366786.pdf?src-supplier=Farnell; ComponentLink12Description: http://www.farnell.com/datasheets/2366786.pdf?src-supplier=Farnell; ComponentLink13URL: https://cdn.amphenol-icc.com/media/wysiwyg/files/documentation/datasheet/inputoutput/io_usb_micro.pdf?src-supplier=TME; ComponentLink13Description: https://cdn.amphenol-icc.com/media/wysiwyg/files/documentation/datasheet/inputoutput/io_usb_micro.pdf?src-supplier=TME; ComponentLink14URL: https://cdn.amphenol-icc.com/media/wysiwyg/files/documentation/datasheet/inputoutput/io_usb_micro.pdf?src-supplier=TTI; ComponentLink14Description: https://cdn.amphenol-icc.com/media/wysiwyg/files/documentation/datasheet/inputoutput/io_usb_micro.pdf?src-supplier=TTI; ComponentLink15URL: https://cdn.amphenol-icc.com/media/wysiwyg/files/documentation/datasheet/inputoutput/io_usb_micro.pdf?src-supplier=NAC+Semi; ComponentLink15Description: https://cdn.amphenol-icc.com/media/wysiwyg/files/documentation/datasheet/inputoutput/io_usb_micro.pdf?src-supplier=NAC+Semi; ComponentLink16URL: https://cdn.amphenol-icc.com/media/wysiwyg/files/documentation/datasheet/inputoutput/io_usb_micro.pdf?src-supplier=SOS+electronic; ComponentLink16Description: https://cdn.amphenol-icc.com/media/wysiwyg/files/documentation/datasheet/inputoutput/io_usb_micro.pdf?src-supplier=SOS+electronic; ComponentLink17URL: https://cdn.amphenol-icc.com/media/wysiwyg/files/documentation/datasheet/inputoutput/io_usb_micro.pdf?src-supplier=Freelance+Electronics; ComponentLink17Description: https://cdn.amphenol-icc.com/media/wysiwyg/files/documentation/datasheet/inputoutput/io_usb_micro.pdf?src-supplier=Freelance+Electronics; ComponentLink18URL: https://cdn.amphenol-icc.com/media/wysiwyg/files/documentation/datasheet/inputoutput/io_usb_micro.pdf?src-supplier=Heilind+Electronics; ComponentLink18Description: https://cdn.amphenol-icc.com/media/wysiwyg/files/documentation/datasheet/inputoutput/io_usb_micro.pdf?src-supplier=Heilind+Electronics; ComponentLink19URL: https://datasheet.ciiva.com/3094/1050170001-io-connectors-3094416.pdf?src-supplier=Avnet; ComponentLink19Description: https://datasheet.ciiva.com/3094/1050170001-io-connectors-3094416.pdf?src-supplier=Avnet; ComponentLink20URL: https://datasheet.ciiva.com/30165/235271050170001-io-nectors-30165183.pdf?src-supplier=Onlinecomponents.com; ComponentLink20Description: https://datasheet.ciiva.com/30165/235271050170001-io-nectors-30165183.pdf?src-supplier=Onlinecomponents.com; ComponentLink21URL: https://datasheet.ciiva.com/5742/1598502-5742508.pdf?src-supplier=Farnell; ComponentLink21Description: https://datasheet.ciiva.com/5742/1598502-5742508.pdf?src-supplier=Farnell; ComponentLink22URL: https://datasheet.ciiva.com/8015/1631959-8015288.pdf?src-supplier=Element14; ComponentLink22Description: https://datasheet.ciiva.com/8015/1631959-8015288.pdf?src-supplier=Element14; ComponentLink23URL: https://datasheet.ciiva.com/22654/1688140-22654924.pdf?src-supplier=Element14; ComponentLink23Description: https://datasheet.ciiva.com/22654/1688140-22654924.pdf?src-supplier=Element14; ComponentLink24URL: https://datasheet.ciiva.com/4598/1050170001-io-connectors-152207-4598759.pdf?src-supplier=Mouser; ComponentLink24Description: https://datasheet.ciiva.com/4598/1050170001-io-connectors-152207-4598759.pdf?src-supplier=Mouser; ComponentLink25URL: https://datasheet.ciiva.com/851/1050170001-sd-851276.pdf?src-supplier=Digi-Key; ComponentLink25Description: https://datasheet.ciiva.com/851/1050170001-sd-851276.pdf?src-supplier=Digi-Key; ComponentLink26URL: https://datasheet.ciiva.com/16668/1050170001-io-connectors-16668598.pdf?src-supplier=Avnet+Europe; ComponentLink26Description: https://datasheet.ciiva.com/16668/1050170001-io-connectors-16668598.pdf?src-supplier=Avnet+Europe; ComponentLink27URL: https://datasheet.ciiva.com/851/1050170001-sd-851277.pdf?src-supplier=Digi-Key; ComponentLink27Description: https://datasheet.ciiva.com/851/1050170001-sd-851277.pdf?src-supplier=Digi-Key; ComponentLink28URL: https://datasheet.ciiva.com/851/1050170001-sd-851278.pdf?src-supplier=Digi-Key; ComponentLink28Description: https://datasheet.ciiva.com/851/1050170001-sd-851278.pdf?src-supplier=Digi-Key; Supplier 1: Digi-Key; RoHS: Yes; Category: USB Connectors; Stock 1: 169666; Pricing 1: 1=0,480000, 10=0,420000, 25=0,384400, 50=0,361600, 100=0,346600, 250=0,316400, 500=0,301360 (USD); ComponentLink29URL: http://components.arrow.com/part/dataview/0323_04107373?src-supplier=Arrow+Europe; ComponentLink29Description: http://components.arrow.com/part/dataview/0323_04107373?src-supplier=Arrow+Europe; ComponentLink30URL: https://cdn.amphenol-icc.com/media/wysiwyg/files/drawing/10118194.pdf?src-supplier=Avnet; ComponentLink30Description: https://cdn.amphenol-icc.com/media/wysiwyg/files/drawing/10118194.pdf?src-supplier=Avnet; ComponentLink31URL: https://cdn.amphenol-icc.com/media/wysiwyg/files/drawing/10118194.pdf?src-supplier=Mouser; ComponentLink31Description: https://cdn.amphenol-icc.com/media/wysiwyg/files/drawing/10118194.pdf?src-supplier=Mouser; ComponentLink32URL: http://www.amphenol-icc.com/media/wysiwyg/files/drawing/10118194.pdf?src-supplier=Digi-Key; ComponentLink32Description: http://www.amphenol-icc.com/media/wysiwyg/files/drawing/10118194.pdf?src-supplier=Digi-Key; ComponentLink33URL: http://www.farnell.com/cad/2354948.pdf?src-supplier=Farnell; ComponentLink33Description: http://www.farnell.com/cad/2354948.pdf?src-supplier=Farnell; ComponentLink34URL: https://cdn.amphenol-icc.com/media/wysiwyg/files/drawing/10118194.pdf?src-supplier=RSComponents; ComponentLink34Description: https://cdn.amphenol-icc.com/media/wysiwyg/files/drawing/10118194.pdf?src-supplier=RSComponents; ComponentLink35URL: https://cdn.amphenol-icc.com/media/wysiwyg/files/drawing/10118194.pdf?src-supplier=Allied+Electronics; ComponentLink35Description: https://cdn.amphenol-icc.com/media/wysiwyg/files/drawing/10118194.pdf?src-supplier=Allied+Electronics; ComponentLink36URL: https://cdn.amphenol-icc.com/media/wysiwyg/files/drawing/10118194.pdf?src-supplier=Verical; ComponentLink36Description: https://cdn.amphenol-icc.com/media/wysiwyg/files/drawing/10118194.pdf?src-supplier=Verical; ComponentLink37URL: https://cdn.amphenol-icc.com/media/wysiwyg/files/drawing/10118194.pdf?src-supplier=Arrow+Electronics; ComponentLink37Description: https://cdn.amphenol-icc.com/media/wysiwyg/files/drawing/10118194.pdf?src-supplier=Arrow+Electronics; ComponentLink38URL: https://cdn.amphenol-icc.com/media/wysiwyg/files/drawing/10118194.pdf?src-supplier=TTI; ComponentLink38Description: https://cdn.amphenol-icc.com/media/wysiwyg/files/drawing/10118194.pdf?src-supplier=TTI; ComponentLink39URL: https://cdn.amphenol-icc.com/media/wysiwyg/files/drawing/10118194.pdf?src-supplier=NAC+Semi; ComponentLink39Description: https://cdn.amphenol-icc.com/media/wysiwyg/files/drawing/10118194.pdf?src-supplier=NAC+Semi; ComponentLink40URL: https://cdn.amphenol-icc.com/media/wysiwyg/files/drawing/10118194.pdf?src-supplier=SOS+electronic; ComponentLink40Description: https://cdn.amphenol-icc.com/media/wysiwyg/files/drawing/10118194.pdf?src-supplier=SOS+electronic; ComponentLink41URL: https://cdn.amphenol-icc.com/media/wysiwyg/files/drawing/10118194.pdf?src-supplier=Quest; ComponentLink41Description: https://cdn.amphenol-icc.com/media/wysiwyg/files/drawing/10118194.pdf?src-supplier=Quest; ComponentLink42URL: https://cdn.amphenol-icc.com/media/wysiwyg/files/drawing/10118194.pdf?src-supplier=Heilind+Electronics; ComponentLink42Description: https://cdn.amphenol-icc.com/media/wysiwyg/files/drawing/10118194.pdf?src-supplier=Heilind+Electronics; ComponentLink43URL: https://cdn.amphenol-icc.com/media/wysiwyg/files/drawing/10118194.pdf?src-supplier=TME; ComponentLink43Description: https://cdn.amphenol-icc.com/media/wysiwyg/files/drawing/10118194.pdf?src-supplier=TME; Supplier Part Number 1: 609-4618-1-ND; RoHS Compliant: Yes; ComponentLink44URL: http://www.farnell.com/cad/2354948.pdf?src-supplier=Element14; ComponentLink44Description: http://www.farnell.com/cad/2354948.pdf?src-supplier=Element14; Supplier 2: Mouser; Supplier Part Number 2: 649-10118194-0001LF; Manufacturer Part Number 1: 10118194-0001LF
J2 = F32R-1A7H1-11024: CONN - FPC/FFC Connector Socket 24 Position 0.5mm Bottom Contact Solder Right Angle Surface Mount T/R; Manufacturer 1: Amphenol ICC / FCI; .SCHChecked: Victor H; Supplier 1: Mouser; Manufacturer Part Number 1: F32R-1A7H1-11024; RoHS: No; Category: FFC / FPC; Stock 1: 588; Pricing 1: 1=0,82000, 10=0,64500, 50=0,64500, 100=0,56100, 500=0,50500, 1000=0,38300, 2500=0,36400, 10000=0,36400 (USD); .PCBChecked: Victor H; Supplier Part Number 1: 649-F32R-1A7H1-11024
J3 J5 = PH1-12-UA: CONN - HEADER VERT 12POS 2.54MM; Manufacturer 1: Adam Equipment; .SCHChecked: Victor H; .PCBChecked: Victor H; ComponentLink1URL: http://www.adam-tech.com/catalog/2012/page_312-315.pdf?src-supplier=Future+Electronics; ComponentLink1Description: http://www.adam-tech.com/catalog/2012/page_312-315.pdf?src-supplier=Future+Electronics; Supplier 1: Digi-Key; RoHS: Yes; Category: Headers and Wire Housings; Stock 1: 4680; Pricing 1: 1=0,21000, 10=0,17600, 100=0,13510, 500=0,11434, 1000=0,09356, 5000=0,08316, 10000=0,07536 (USD); Lead Free: Lead Free; ComponentLink2URL: https://datasheet.ciiva.com/16480/page-312-315-16480233.pdf?src-supplier=Future+Electronics; ComponentLink2Description: https://datasheet.ciiva.com/16480/page-312-315-16480233.pdf?src-supplier=Future+Electronics; Supplier Part Number 1: 2057-PH1-12-UA-ND; Manufacturer Part Number 1: PH1-12-UA
Q1-Q3 = MMSS8050-H-TP: TRANSISTOR - NPN 25V 1.5A SOT23; Manufacturer 1: MCC; hFE Min: 120; Max Power Dissipation: 625mW; Collector Emitter Voltage (VCEO): 500mV; Collector Base Voltage (VCBO): 40V; Emitter Base Voltage (VEBO): 5V; Transition Frequency: 100MHz; Element Configuration: Single; .SCHChecked: Victor H; mouting: SMD; ComponentLink1URL: https://datasheet.ciiva.com/18648/dss5320t-18648043.pdf?src-supplier=Digi-Key; ComponentLink1Description: https://datasheet.ciiva.com/18648/dss5320t-18648043.pdf?src-supplier=Digi-Key; ComponentLink2URL: https://datasheet.ciiva.com/11206/dss5320t-11206349.pdf?src-supplier=Avnet; ComponentLink2Description: https://datasheet.ciiva.com/11206/dss5320t-11206349.pdf?src-supplier=Avnet; Supplier 1: Digi-Key; RoHS: Yes; Category: BJTs; Stock 1: 87310; Pricing 1: 1=0,21000, 10=0,17100, 100=0,09060, 500=0,05962, 1000=0,04054 (USD); Mount: Surface Mount; Case/Package: SOT-23; Number of Pins: 3; Min Operating Temperature: -55°C; Max Operating Temperature: 150°C; Packaging: Tape and Reel; Package Quantity: 3000; Polarity: NPN; Collector Emitter Saturation Voltage: 500mV; Max Collector Current: 1.5A; Collector Emitter Breakdown Voltage: 25V; Max Breakdown Voltage: 25V; Gain Bandwidth Product: 100MHz; Collector-emitter Voltage-Max: 500mV; Series: -; Lead Free: Lead Free; RoHS Compliant: Yes; ComponentLink3URL: https://datasheet.ciiva.com/16291/mmss8050-255048-16291447.pdf?src-supplier=Mouser; ComponentLink3Description: https://datasheet.ciiva.com/16291/mmss8050-255048-16291447.pdf?src-supplier=Mouser; ComponentLink4URL: https://datasheet.ciiva.com/972/mmss8050sot-23-972894.pdf?src-supplier=Digi-Key; ComponentLink4Description: https://datasheet.ciiva.com/972/mmss8050sot-23-972894.pdf?src-supplier=Digi-Key; ComponentLink5URL: https://datasheet.ciiva.com/972/mmss8050sot-23-972895.pdf?src-supplier=Digi-Key; ComponentLink5Description: https://datasheet.ciiva.com/972/mmss8050sot-23-972895.pdf?src-supplier=Digi-Key; ComponentLink6URL: https://datasheet.ciiva.com/972/mmss8050sot-23-972893.pdf?src-supplier=Digi-Key; ComponentLink6Description: https://datasheet.ciiva.com/972/mmss8050sot-23-972893.pdf?src-supplier=Digi-Key; Supplier Part Number 1: MMSS8050-H-TPMSCT-ND; Manufacturer Part Number 1: MMSS8050-H-TP; .PCBChecked: Victor H
R3 R10 R11 R28 R30 = RNCP0805FTD1K00: RES - 1K 1/4W 0805 ±1%; Manufacturer 1: Stackpole Electronics; .PCBChecked: Victor Holanda; Resistance: 1kR; Power Rating: 250mW; Temperature Coefficient: 100ppm/°C; .SCHChecked: Victor Holanda; Supplier 1: Digi-Key; RoHS: Yes; Category: Chip SMD Resistors; Stock 1: 333101; Pricing 1: 1=0,10000, 10=0,07300, 100=0,02970, 1000=0,01336, 2500=0,01159 (USD); Mount: Surface Mount; Case/Package: 0805; Case Code (Metric): 2012; Case Code (Imperial): 0805; Size Code: 0805; Min Operating Temperature: -55°C; Max Operating Temperature: 155°C; Tolerance: 1%; Packaging: Tape and Reel; Resistor Type: Thin Film; Number of Terminations: 2; Max Power Dissipation: 250mW; Features: Moisture Resistant,Anti-Sulfur; Series: RNCP; Length: 0.079inch; Width: 0.049inch; Height: 0.024inch; Lead Free: Lead Free; RoHS Compliant: Yes; ComponentLink7URL: http://www.seielect.com/Catalog/SEI-rncp.pdf?src-supplier=Future+Electronics; ComponentLink7Description: http://www.seielect.com/Catalog/SEI-rncp.pdf?src-supplier=Future+Electronics; ComponentLink8URL: https://www.seielect.com/Catalog/SEI-rncp.pdf?src-supplier=Digi-Key; ComponentLink8Description: https://www.seielect.com/Catalog/SEI-rncp.pdf?src-supplier=Digi-Key; ComponentLink9URL: https://www.seielect.com/catalog/SEI-Packaging.pdf?src-supplier=Digi-Key; ComponentLink9Description: https://www.seielect.com/catalog/SEI-Packaging.pdf?src-supplier=Digi-Key; Supplier Part Number 1: RNCP0805FTD1K00CT-ND; Manufacturer Part Number 1: RNCP0805FTD1K00
R4 R19 R23 = ESR10EZPJ472: RES - 4K7 0.4W 0805 ±5%; Manufacturer 1: Rohm; .PCBChecked: Victor Holanda; Resistance: 4.7kR; Temperature Coefficient: 200ppm/°C; Power Rating: 400mW; .SCHChecked: Victor Holanda; Supplier 1: Digi-Key; RoHS: Yes; Category: Chip SMD Resistors; Stock 1: 374197; Pricing 1: 1=0,10000, 10=0,09000, 100=0,03450, 1000=0,01518, 2500=0,01311 (USD); Case/Package: 0805; Case Code (Imperial): 0805; Case Code (Metric): 2012; Size Code: 0805; Tolerance: 5%; Features: Automotive AEC-Q200; Series: ESR; Packaging: Tape and Reel; Max Power Dissipation: 400mW; Number of Terminations: 2; Lead Free: Lead Free; RoHS Compliant: Yes; ComponentLink7URL: https://datasheet.ciiva.com/16212/esr10ezpd-16212069.pdf?src-supplier=Future+Electronics; ComponentLink7Description: https://datasheet.ciiva.com/16212/esr10ezpd-16212069.pdf?src-supplier=Future+Electronics; Supplier Part Number 1: RHM4.7KKCT-ND; Manufacturer Part Number 1: ESR10EZPJ472
R6 = ERJ-6DQJ3R0V: RES - 3Ω 1/2W 0805 ±5%; Manufacturer 1: Panasonic; Resistance: 3R; Max Power Dissipation: 500mW; Temperature Coefficient: 100ppm/°C; .SCHChecked: Victor H; Supplier 1: Digi-Key; Manufacturer Part Number 1: ERJ-6DQJ3R0V; RoHS: Yes; Category: Chip SMD Resistors; Stock 1: 5000; Pricing 1: 1=0,24000, 10=0,20600, 25=0,15000, 50=0,10880, 100=0,08070, 250=0,06192, 500=0,04878, 1000=0,03377 (USD); Case/Package: 0805; Case Code (Metric): 2012; Case Code (Imperial): 0805; Min Operating Temperature: -55°C; Max Operating Temperature: 155°C; Packaging: Tape and Reel; Resistor Type: Thick Film; Number of Terminations: 2; Tolerance: 5%; Features: Automotive AEC-Q200; Length: 0.079inch; Width: 0.049inch; Height: 0.028inch; ComponentLink1URL: https://industrial.panasonic.com/cdbs/www-data/pdf/RDN0000/AOA0000C313.pdf?src-supplier=Digi-Key; ComponentLink1Description: https://industrial.panasonic.com/cdbs/www-data/pdf/RDN0000/AOA0000C313.pdf?src-supplier=Digi-Key; Supplier Part Number 1: P19231CT-ND; .PCBChecked: Victor H
R7 R20 R25 R27 R31 R33 = RNCP0805FTD10K0: RES - 10K 1/4W 0805 ±1%; Manufacturer 1: Stackpole Electronics; .PCBChecked: Victor Holanda; Resistance: 10kR; Max Power Dissipation: 250mW; Temperature Coefficient: 100ppm/°C; .SCHChecked: Victor Holanda; Supplier 1: Digi-Key; RoHS: Yes; Category: Chip SMD Resistors; Stock 1: 744134; Pricing 1: 1=0,10000, 10=0,07300, 100=0,02970, 1000=0,01336, 2500=0,01159 (USD); Mount: Surface Mount; Case/Package: 0805; Case Code (Metric): 2012; Case Code (Imperial): 0805; Min Operating Temperature: -55°C; Max Operating Temperature: 155°C; Tolerance: 1%; Packaging: Tape and Reel; Resistor Type: Thin Film; Number of Terminations: 2; Features: Moisture Resistant,Anti-Sulfur; Series: RNCP; Length: 0.079inch; Width: 0.049inch; Height: 0.024inch; Lead Free: Lead Free; RoHS Compliant: Yes; ComponentLink7URL: https://www.seielect.com/catalog/SEI-Packaging.pdf?src-supplier=Digi-Key; ComponentLink7Description: https://www.seielect.com/catalog/SEI-Packaging.pdf?src-supplier=Digi-Key; Supplier Part Number 1: RNCP0805FTD10K0CT-ND; Manufacturer Part Number 1: RNCP0805FTD10K0
R9 R32 = RMCF0805FT30K0: RES - 30K 1/8W 0805 ±1%; Manufacturer: Stackpole Electronics; Resistance: 30kR; Max Power Dissipation: 125mW; Temperature Coefficient: 100ppm/°C; .SCHChecked: Victor H; Supplier 1: Digi-Key; Manufacturer Part Number: RMCF0805FT30K0; RoHS: Yes; Category: Chip SMD Resistors; Stock 1: 854420; Pricing 1: 1=0,10000, 10=0,02700, 100=0,01090, 1000=0,00488, 2500=0,00423 (USD); Mount: Surface Mount; Case/Package: 0805; Contact Plating: Tin,Matte; Min Operating Temperature: -55°C; Max Operating Temperature: 155°C; Packaging: Tape and Reel; Tolerance: 1%; Resistor Type: Thick Film; Package Quantity: 5000; Number of Terminations: 2; Features: Automotive AEC-Q200; Series: RMCF; Length: 0.079inch; Width: 0.049inch; Height: 0.026inch; Radiation Hardening: No; Lead Free: Lead Free; RoHS Compliant: Yes; ComponentLink1URL: http://components.arrow.com/part/dataview/40964155S7714593N1174?src-supplier=Arrow+Electronics; ComponentLink1Description: http://components.arrow.com/part/dataview/40964155S7714593N1174?src-supplier=Arrow+Electronics; ComponentLink2URL: https://www.seielect.com/catalog/sei-rmcf_rmcp.pdf?src-supplier=Digi-Key; ComponentLink2Description: https://www.seielect.com/catalog/sei-rmcf_rmcp.pdf?src-supplier=Digi-Key; ComponentLink3URL: https://www.seielect.com/catalog/SEI-Packaging.pdf?src-supplier=Digi-Key; ComponentLink3Description: https://www.seielect.com/catalog/SEI-Packaging.pdf?src-supplier=Digi-Key; ComponentLink4URL: https://www.seielect.com/catalog/SEI-RMCF_RMCP.pdf?src-supplier=Avnet; ComponentLink4Description: https://www.seielect.com/catalog/SEI-RMCF_RMCP.pdf?src-supplier=Avnet; Supplier Part Number 1: RMCF0805FT30K0CT-ND; .PCBChecked: Victor H; mounting: SMD
R18 R22 R26 = RNCP0805FTD47K5: RES - 47K5 1/4W 0805 ±1%; Manufacturer 1: Stackpole Electronics; .PCBChecked: Victor H; Resistance: 47.5kR; Max Power Dissipation: 250mW; Temperature Coefficient: 100ppm/°C; .SCHChecked: Victor H; Supplier 1: Digi-Key; Manufacturer Part Number 1: RNCP0805FTD47K5; RoHS: Yes; Category: Chip SMD Resistors; Stock 1: 36830; Pricing 1: 1=0,10000, 10=0,07300, 100=0,02970, 1000=0,01336, 2500=0,01159 (USD); Mount: Surface Mount; Case/Package: 0805; Case Code (Metric): 2012; Case Code (Imperial): 0805; Min Operating Temperature: -55°C; Max Operating Temperature: 155°C; Tolerance: 1%; Packaging: Tape and Reel; Resistor Type: Thin Film; Number of Terminations: 2; Features: Moisture Resistant,Anti-Sulfur; Series: RNCP; Length: 0.079inch; Width: 0.049inch; Height: 0.024inch; RoHS Compliant: Yes; ComponentLink7URL: http://www.seielect.com/Catalog/SEI-rncp.pdf?src-supplier=Digi-Key; ComponentLink7Description: http://www.seielect.com/Catalog/SEI-rncp.pdf?src-supplier=Digi-Key; ComponentLink8URL: https://www.seielect.com/catalog/SEI-Packaging.pdf?src-supplier=Digi-Key; ComponentLink8Description: https://www.seielect.com/catalog/SEI-Packaging.pdf?src-supplier=Digi-Key; Supplier Part Number 1: RNCP0805FTD47K5CT-ND
R21 = RMCF0805FT120K: RES - 120K 1/8W 0805 ±1%; Manufacturer: Stackpole Electronics; Resistance: 120kR; Max Power Dissipation: 125mW; Temperature Coefficient: 100ppm/°C; Supplier 1: Digi-Key; Manufacturer Part Number: RMCF0805FT120K; RoHS: Yes; Category: Chip SMD Resistors; Stock 1: 24760; Pricing 1: 1=0,10000, 10=0,02700, 100=0,01090, 1000=0,00488, 2500=0,00423 (USD); Mount: Surface Mount; Case/Package: 0805; Case Code (Metric): 2012; Case Code (Imperial): 0805; Contact Plating: Tin,Matte; Min Operating Temperature: -55°C; Max Operating Temperature: 155°C; Tolerance: 1%; Packaging: Tape and Reel; Resistor Type: Thick Film; Number of Terminations: 2; Features: Automotive AEC-Q200; Series: RMCF; Length: 0.079inch; Width: 0.049inch; Height: 0.026inch; Radiation Hardening: No; Lead Free: Lead Free; RoHS Compliant: Yes; ComponentLink1URL: https://www.seielect.com/catalog/SEI-Packaging.pdf?src-supplier=Digi-Key; ComponentLink1Description: https://www.seielect.com/catalog/SEI-Packaging.pdf?src-supplier=Digi-Key; ComponentLink2URL: https://www.seielect.com/Catalog/SEI-RMCF_RMCP.pdf?src-supplier=Digi-Key; ComponentLink2Description: https://www.seielect.com/Catalog/SEI-RMCF_RMCP.pdf?src-supplier=Digi-Key; ComponentLink3URL: https://www.seielect.com/catalog/SEI-RMCF_RMCP.pdf?src-supplier=Avnet; ComponentLink3Description: https://www.seielect.com/catalog/SEI-RMCF_RMCP.pdf?src-supplier=Avnet; Supplier Part Number 1: RMCF0805FT120KCT-ND
R24 = RMCF0805FT22K1: RES - 22K1 1/8W 0805 ±1%; Manufacturer 1: Stackpole Electronics; .PCBChecked: Victor H; Resistance: 22.1kR; Power Rating: 125mW; Temperature Coefficient: 100ppm/°C; .SCHChecked: Victor H; ComponentLink7URL: https://datasheet.ciiva.com/15193/getdatasheetpartid-409700-15193558.pdf?src-supplier=Verical; ComponentLink7Description: https://datasheet.ciiva.com/15193/getdatasheetpartid-409700-15193558.pdf?src-supplier=Verical; Supplier 1: Digi-Key; RoHS: Yes; Category: Chip SMD Resistors; Stock 1: 1311048; Pricing 1: 1=0,10000, 10=0,02700, 100=0,01090, 1000=0,00488, 2500=0,00423 (USD); Mount: Surface Mount; Case/Package: 0805; Case Code (Metric): 2012; Case Code (Imperial): 0805; Contact Plating: Tin,Matte; Size Code: 0805; Min Operating Temperature: -55°C; Max Operating Temperature: 155°C; Packaging: Tape and Reel; Tolerance: 1%; Resistor Type: Thick Film; Number of Terminations: 2; Max Power Dissipation: 125mW; Features: Automotive AEC-Q200; Series: RMCF; Construction: Rectangular; Length: 0.079inch; Width: 0.049inch; Height: 0.026inch; Depth: 1.25mm; Radiation Hardening: No; Military Standard: Not; Lead Free: Lead Free; RoHS Compliant: Yes; Supplier Part Number 1: RMCF0805FT22K1CT-ND; Manufacturer Part Number 1: RMCF0805FT22K1
R29 = RMCF0805ZT0R00: RES - 0R 1/8W 0805; Manufacturer 1: Stackpole Electronics; .PCBChecked: Victor Holanda; Power Rating: 125mW; mouting: SMD; .SCHChecked: Victor Holanda; Supplier 1: Digi-Key; Manufacturer Part Number 1: RMCF0805ZT0R00; RoHS: Yes; Category: Chip SMD Resistors; Stock 1: 6449300; Pricing 1: 1=0,10000, 10=0,01700, 25=0,01280, 50=0,00960, 100=0,00710, 250=0,00540, 500=0,00432, 1000=0,00318 (USD); Mount: Surface Mount; Case/Package: 0805; Case Code (Metric): 2012; Case Code (Imperial): 0805; Contact Plating: Tin,Matte; Size Code: 0805; Min Operating Temperature: -55°C; Max Operating Temperature: 155°C; Resistance: 0R; Packaging: Tape and Reel; Resistor Type: Thick Film; Number of Terminations: 2; Max Power Dissipation: 125mW; Features: Automotive AEC-Q200; Series: RMCF; Construction: Rectangular; Length: 2mm; Width: 0.049inch; Height: 0.026inch; Depth: 1.25mm; Radiation Hardening: No; Lead Free: Lead Free; Military Standard: Not; RoHS Compliant: Yes; ComponentLink7URL: https://datasheet.ciiva.com/15193/getdatasheetpartid-360417-15193658.pdf?src-supplier=Verical; ComponentLink7Description: https://datasheet.ciiva.com/15193/getdatasheetpartid-360417-15193658.pdf?src-supplier=Verical; Supplier Part Number 1: RMCF0805ZT0R00CT-ND
TP11-TP25 = Test_Point: MECH - Test Points
U1 = BD70HC5WEFJ-E2: IC - LDO Voltage Controllers LDO Reg Pos 7.0V 1.5A; Manufacturer 1: Rohm; Max Power Dissipation: 2.11W; Dropout Voltage: 600mV; Max Input Voltage: 8V; Output Voltage: 7V; Number of Outputs: 1; Min Input Voltage: 4.5V; Output Type: Fixed; .PCBChecked: Victor H; Supplier 1: Digi-Key; Manufacturer Part Number 1: BD70HC5WEFJ-E2; RoHS: Yes; Category: Voltage Regulators - Linear; Stock 1: 4936; Pricing 1: 1=0,75000, 10=0,65800, 25=0,61760, 100=0,50420, 250=0,46832, 500=0,39856, 1000=0,31885 (USD); Mount: Surface Mount; Number of Pins: 8; Min Operating Temperature: -25°C; Max Operating Temperature: 85°C; Packaging: Tape and Reel; Package Quantity: 1; Output Current: 1.5A; Number of Regulators: 1; Series: -; Lead Free: Lead Free; RoHS Compliant: Yes; ComponentLink1URL: https://datasheet.ciiva.com/12217/bd70hc5wefj-214377-12217508.pdf?src-supplier=Mouser; ComponentLink1Description: https://datasheet.ciiva.com/12217/bd70hc5wefj-214377-12217508.pdf?src-supplier=Mouser; ComponentLink2URL: https://datasheet.ciiva.com/6584/bdxxhc5wefj-e-6584252.pdf?src-supplier=Digi-Key; ComponentLink2Description: https://datasheet.ciiva.com/6584/bdxxhc5wefj-e-6584252.pdf?src-supplier=Digi-Key; ComponentLink3URL: https://datasheet.ciiva.com/6584/bdxxhc5wefj-e-6584253.pdf?src-supplier=Digi-Key; ComponentLink3Description: https://datasheet.ciiva.com/6584/bdxxhc5wefj-e-6584253.pdf?src-supplier=Digi-Key; ComponentLink4URL: https://datasheet.ciiva.com/6584/bdxxhc5wefj-e-6584254.pdf?src-supplier=Digi-Key; ComponentLink4Description: https://datasheet.ciiva.com/6584/bdxxhc5wefj-e-6584254.pdf?src-supplier=Digi-Key; Supplier Part Number 1: BD70HC5WEFJ-E2CT-ND; .SCHChecked: Victor H
U7 = CP2102N-A02-GQFN24R: IC - Full Speed USB to UART Bridge USB 2.0 3.3V T/R Automotive 24-Pin QFN EP; Manufacturer 1: Silicon Labs; .PCBChecked: Victor H; Supplier 1: Digi-Key; Manufacturer Part Number 1: CP2102N-A02-GQFN24R; RoHS: Yes; Category: Interface ICs; Stock 1: 31086; Pricing 1: 1=2,16000 (USD); Supplier 2: Mouser; Supplier Part Number 1: 336-5888-1-ND; .SCHChecked: Victor H; Supplier Part Number 2: 634-CP2102NA02QFN24R
U8 = ESP32-S3: IC - SMD ESP32-S3, Dual-core Mcu,; Manufacturer: Espressif Systems; .SCHChecked: Victor H; .PCBChecked: Victor H; Supplier 1: Digi-Key; Manufacturer Part Number: ESP32-S3; RoHS: No; Stock 1: 2000; Pricing 1: 1=2,04000 (USD); Supplier Part Number 1: 1965-ESP32-S3-ND; mounting: SMD
U9 U10 = AP7366-W5-7: IC - LDO Regulator Positive Adj 0.8V to 5V 600mA 5-Pin SOT-25 T/R; Manufacturer: Diodes; Supplier 1: Digi-Key; Manufacturer Part Number: AP7366-W5-7; RoHS: Yes; Stock 1: 371289; Pricing 1: 1=0,42000, 10=0,31700, 25=0,28640, 100=0,19780, 250=0,16656, 500=0,13532, 1000=0,10409 (USD); ComponentLink1URL: https://www.diodes.com/assets/Datasheets/AP7366.pdf?src-supplier=Digi-Key; ComponentLink1Description: https://www.diodes.com/assets/Datasheets/AP7366.pdf?src-supplier=Digi-Key; Supplier Part Number 1: AP7366-W5-7DICT-ND

## Sheet [05] - REVISION HISTORY.SchDoc
size A3; DocumentNumber: 5; SheetNumber: 5; SheetTotal: 6
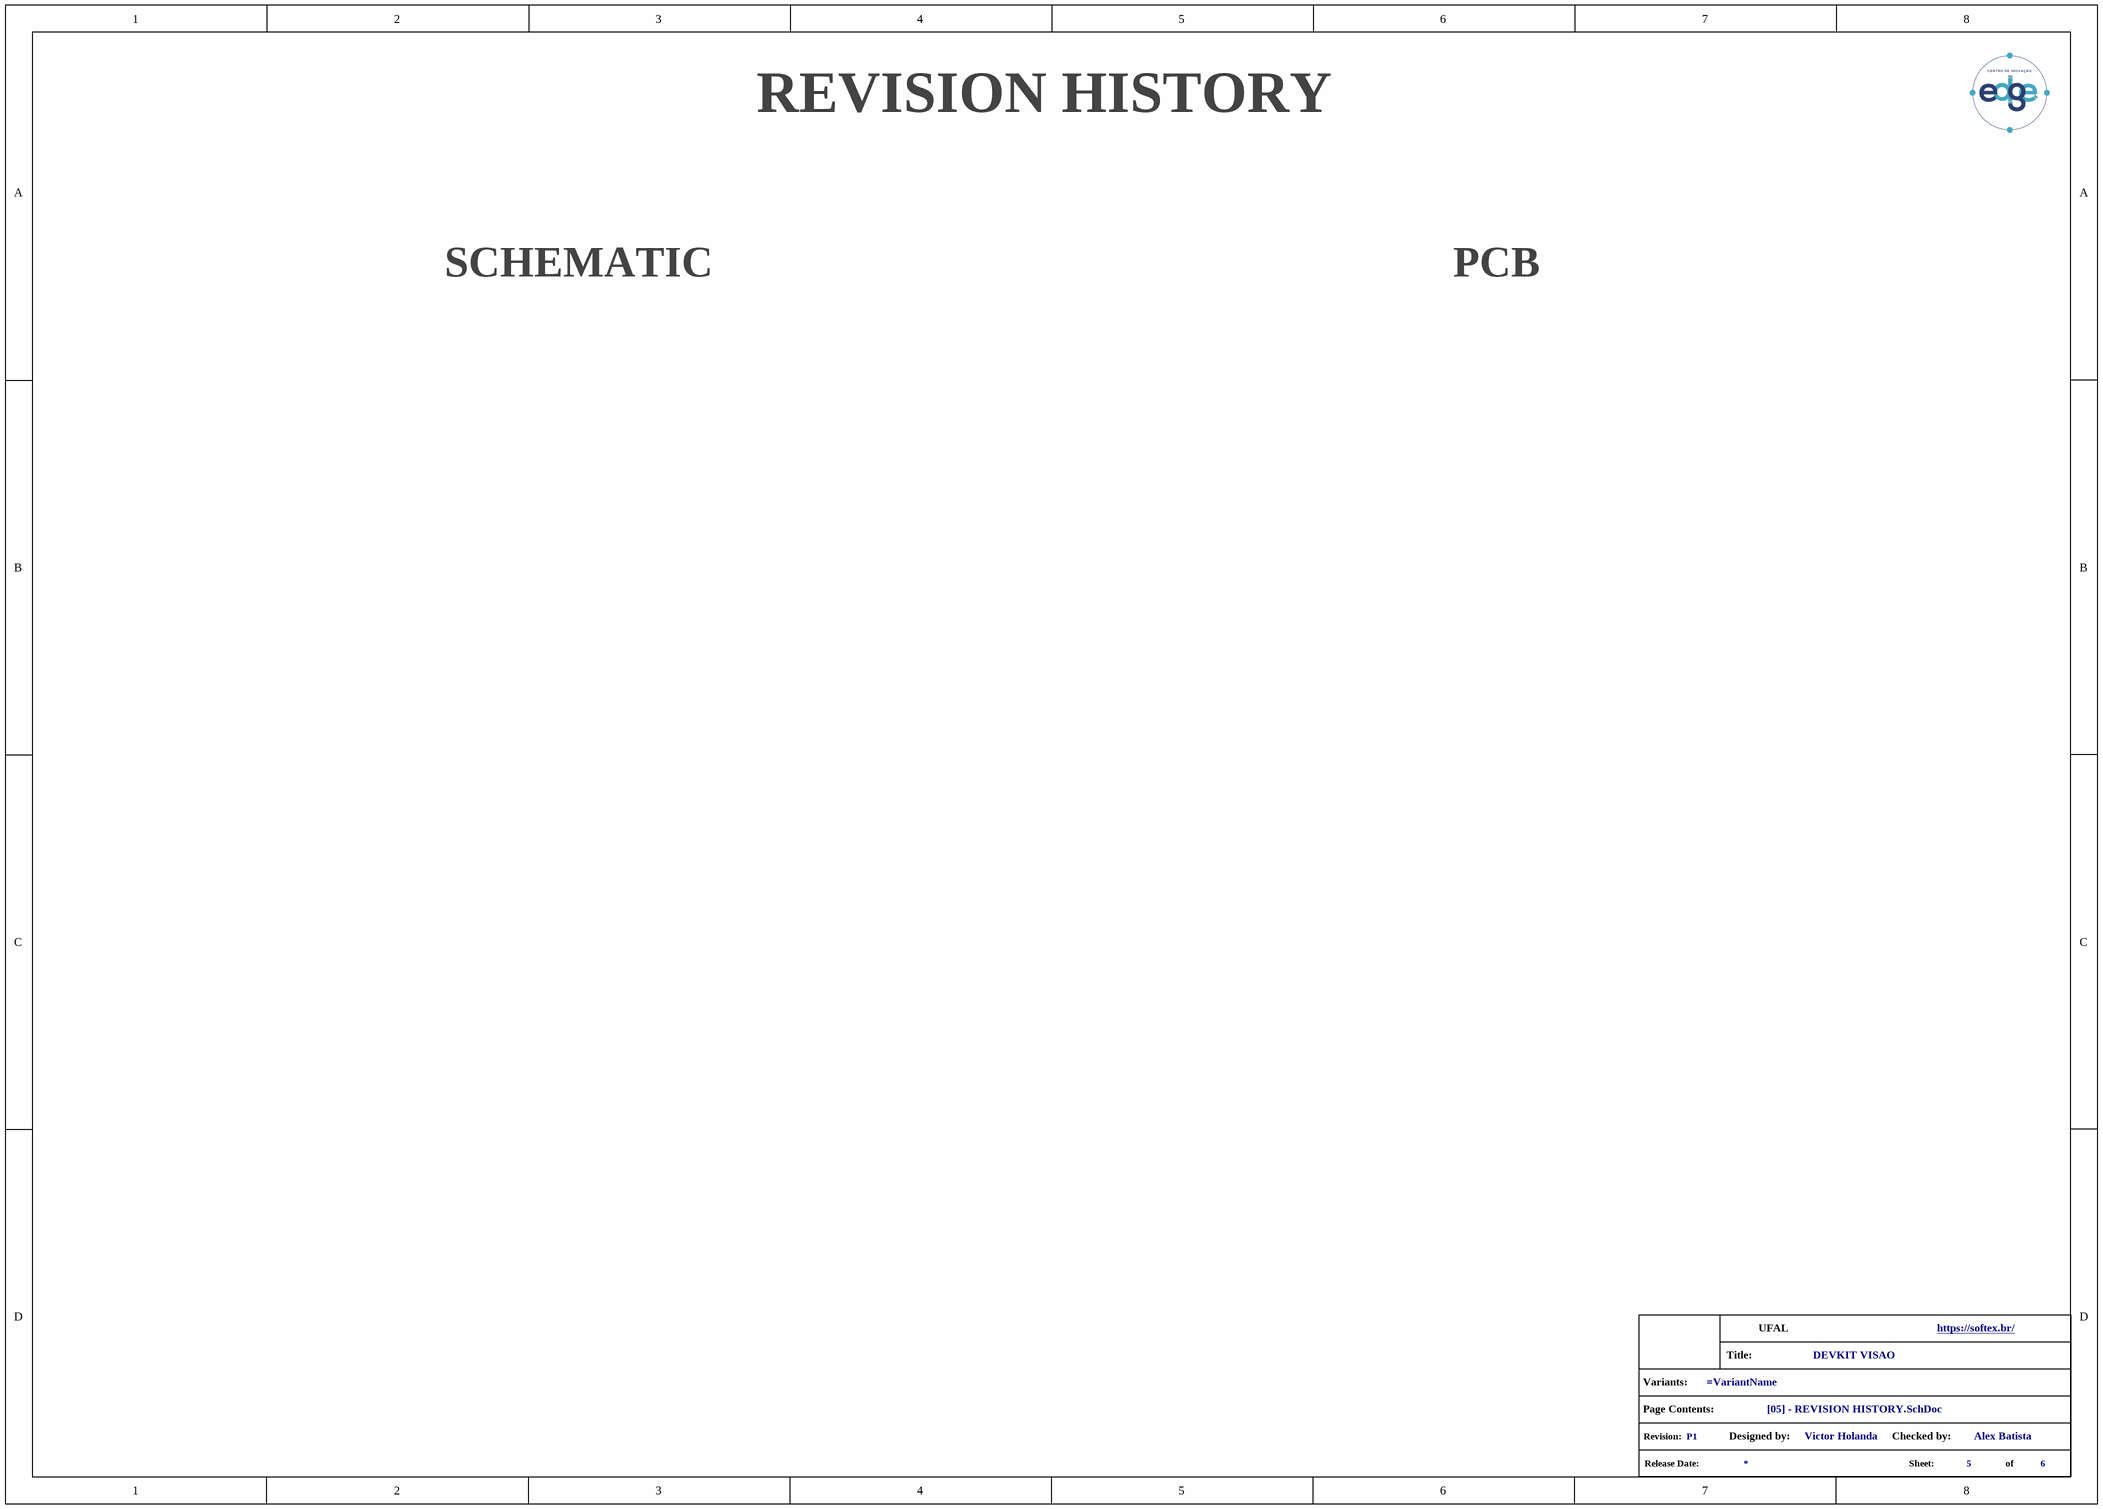
[diagram p5: [05] - REVISION HISTORY.SchDoc]

### Parts
(Parts that share a designator on the sheet are numbered #1, #2 ... from top to bottom, then left to right.)
GPH?#4  info_project  (value not drawn)  (graphical)

### Notes on the sheet
- REVISION HISTORY
- SCHEMATIC
- PCB
- (in symbol info_project) Title:; Variants:; Page Contents:; Revision:; Designed by:; Checked by:; Release Date:; Sheet:; of

### Library data of the parts
GPH?#4 = info_project: GRAPHICAL - Info Project